# Altium project PPC_notebook_electrical_schematics_v0.6.PrjPcb (part 6 of 10)

## Sheet 19C_3G_LTE_MODEM.SchDoc
size 420 x 297 mm
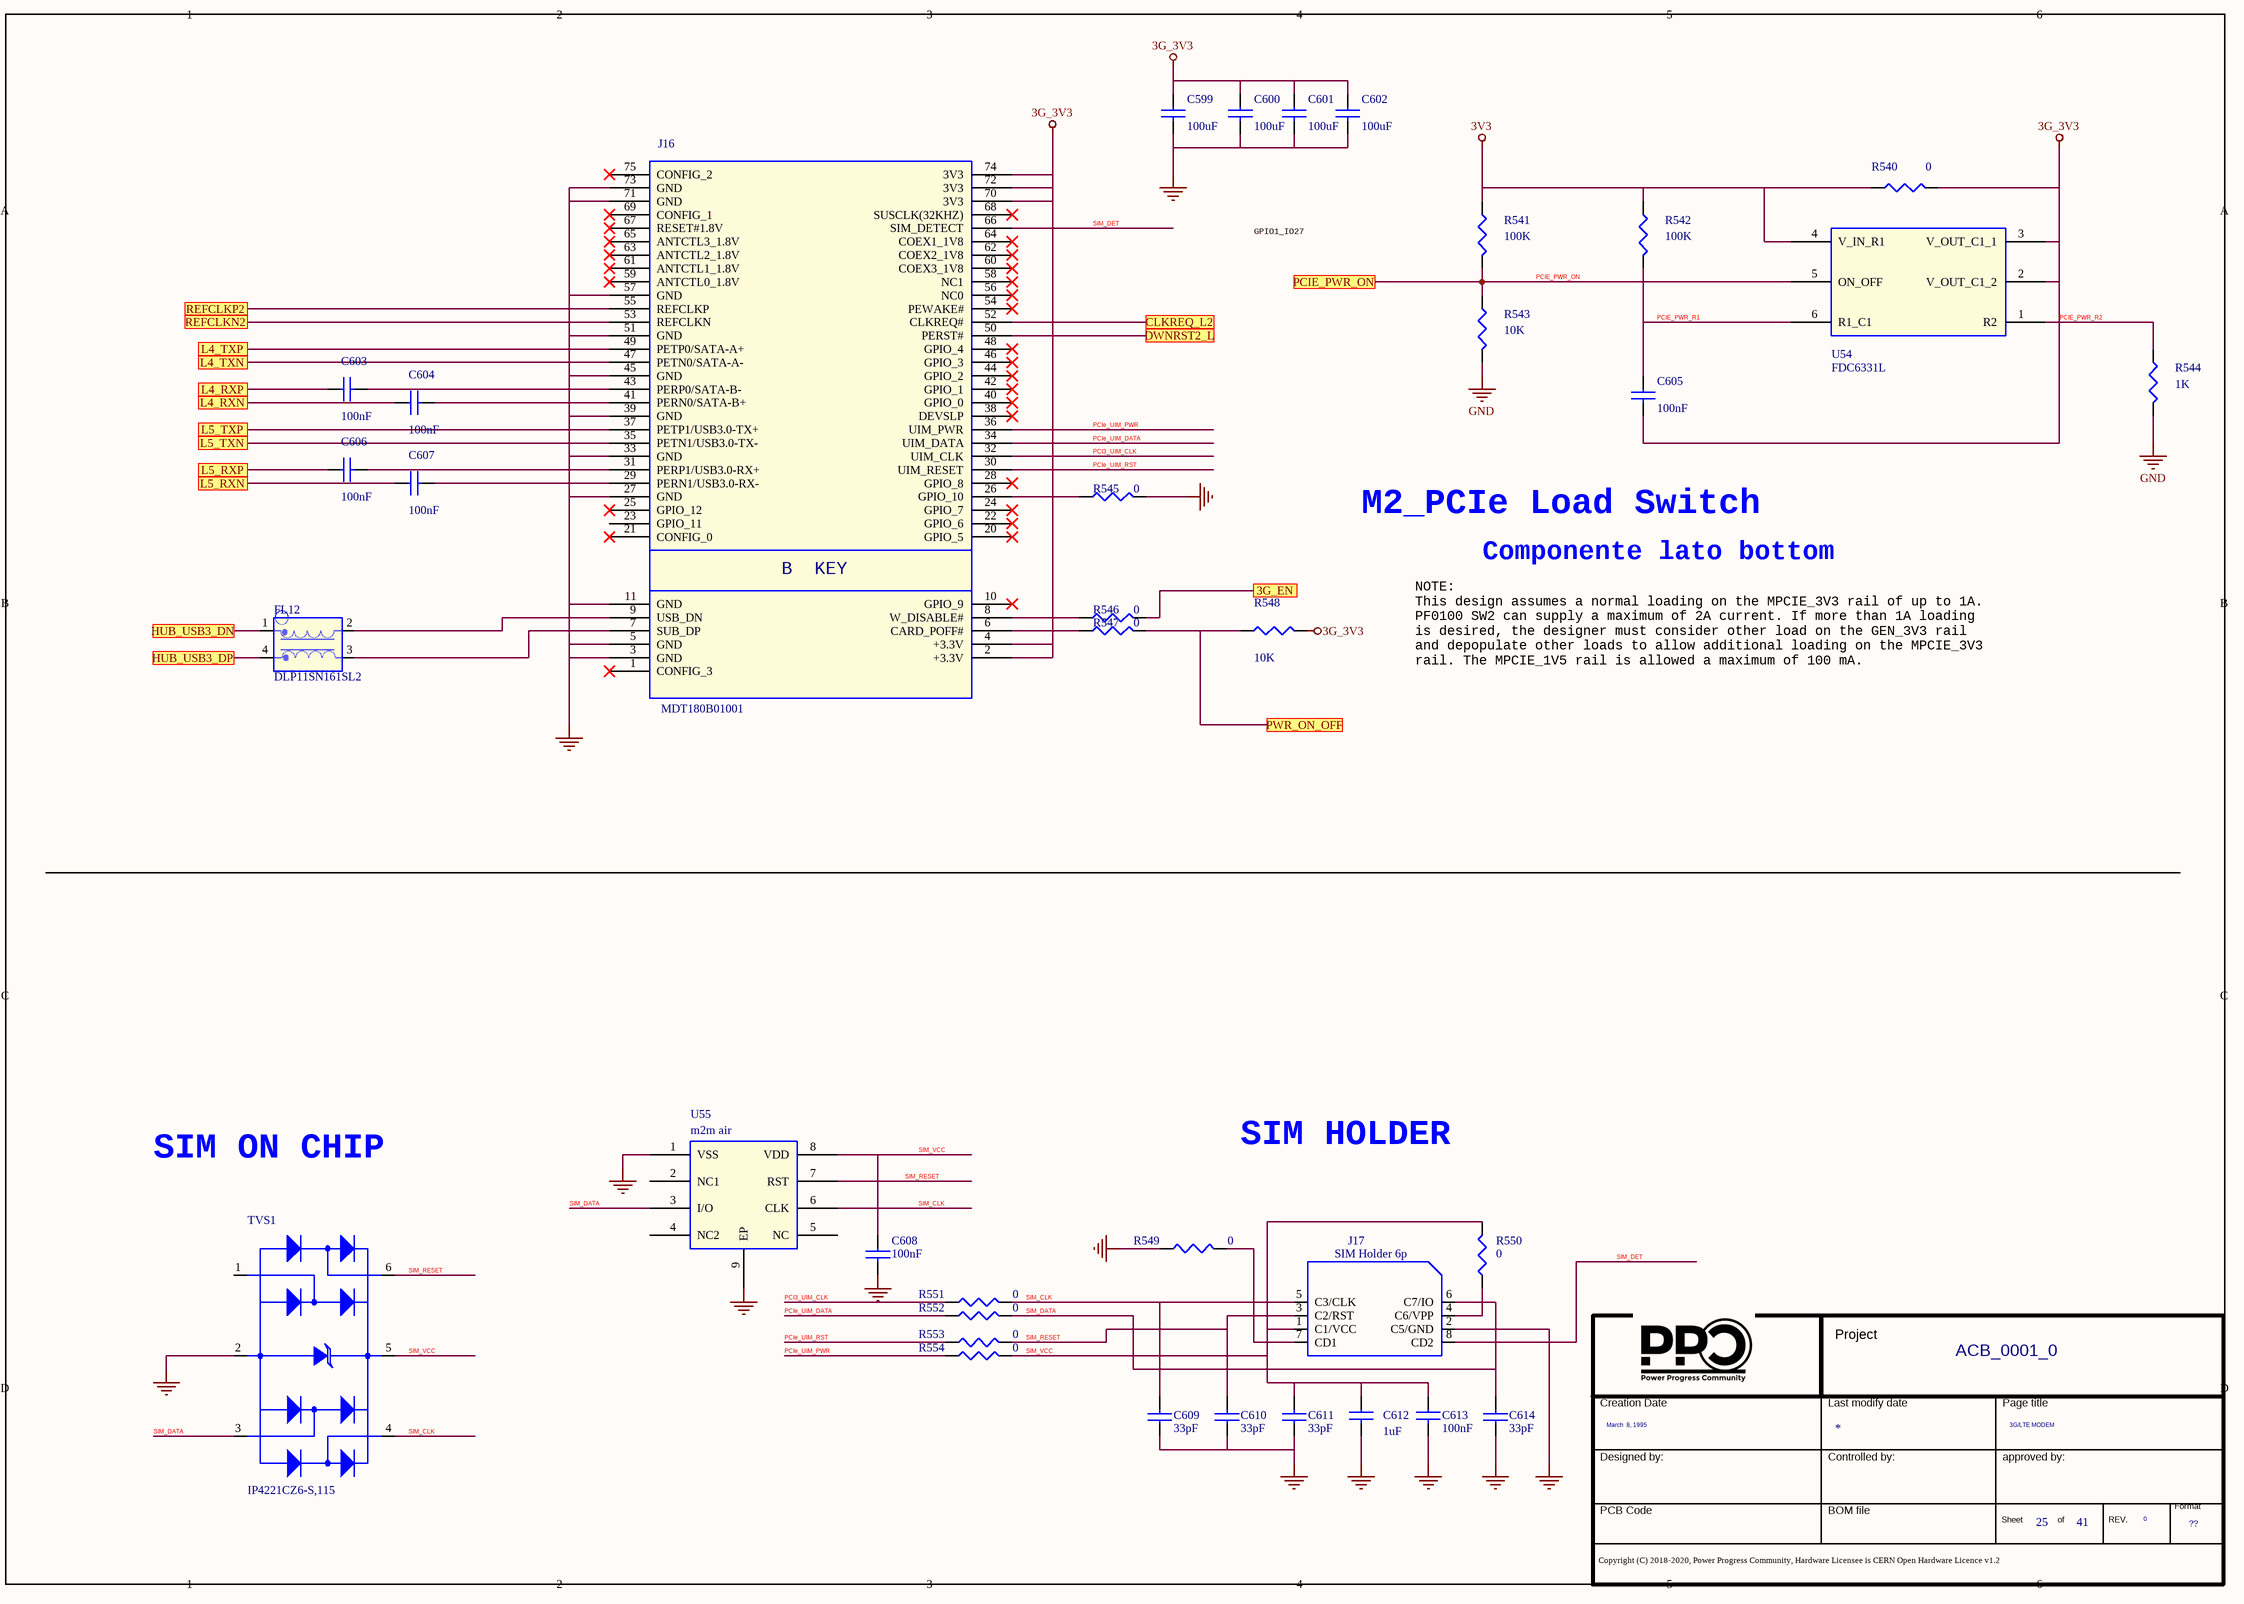
[diagram p40: 19C_3G_LTE_MODEM.SchDoc]

### Parts
(Parts that share a designator on the sheet are numbered #1, #2 ... from top to bottom, then left to right.)
*#27  Page Count: 41  Page Create Date: March  8, 1995  Page Number: 25  Page Size: ??  Page Title: 3G/LTE MODEM  RevCode: 0  Title: ACB_0001_0  (hidden comment: Title_block_PPC)  (graphical)
C599  100uF  [SMD_1210]
C600  100uF  [SMD_1210]
C601  100uF  [SMD_1210]
C602  100uF  [SMD_1210]
C603  100nF  [SMD_0402]
C604  100nF  [SMD_0402]
C605  100nF  [SMD_0402]
C606  100nF  [SMD_0402]
C607  100nF  [SMD_0402]
C608  100nF  [SMD_0402]
C609  33pF  [SMD_0402]
C610  33pF  [SMD_0402]
C611  33pF  [SMD_0402]
C612  1uF  [SMD_0402]
C613  100nF  [SMD_0402]
C614  33pF  [SMD_0402]
FL12  DLP11SN161SL2  [SMD]
J16  MDT180B01001  [67 PIN PASSO 0.5mm]
J17  SIM Holder 6p  [SMD 6 PIN]
R540  0  [SMD_1206]
R541  100K  [SMD_0402]
R542  100K  [SMD_0402]
R543  10K  [SMD_0402]
R544  1K  [SMD_0402]
R545  0  [SMD_0402]
R546  0  [SMD_0402]
R547  0  [SMD_0402]
R548  10K  [SMD_0402]
R549  0  [SMD_0402]
R550  0  [SMD_0402]
R551  0  [SMD_0402]
R552  0  [SMD_0402]
R553  0  [SMD_0402]
R554  0  [SMD_0402]
TVS1  IP4221CZ6-S,115  [	XSON-6]
U54  FDC6331L  [SOT_6]
U55  m2m air  [SO-8]

### Ports
3G_EN, CLKREQ_L2, DWNRST2_L, HUB_USB3_DN, HUB_USB3_DP, L4_RXN, L4_RXP, L4_TXN, L4_TXP, L5_RXN, L5_RXP, L5_TXN, L5_TXP, PCIE_PWR_ON, PWR_ON_OFF, REFCLKN2, REFCLKP2

### Nets
3V3: R540.1 R541.1 R542.1 U54.4(V_IN_R1)
GND: C599.2 C600.2 C601.2 C602.2 C608.2 C609.1 C610.1 C611.1 C612.2 C613.2 C614.1 J16.3(GND) J16.5(GND) J16.11(GND) J16.27(GND) J16.33(GND) J16.39(GND) J16.45(GND) J16.51(GND) J16.57(GND) J16.71(GND) J16.73(GND) J17.2(C5/GND) R543.2 R544.2 R545.2 R549.1 TVS1.2(GND) U55.1(VSS) U55.9(EP)
PCIE_PWR_R2: C599.1 C600.1 C601.1 C602.1 C605.2 J16.2(+3.3V) J16.4(+3.3V) J16.70(3V3) J16.72(3V3) J16.74(3V3) R540.2 R544.1 R548.2 U54.1(R2) U54.2(V_OUT_C1_2) U54.3(V_OUT_C1_1)  [also labelled 3G_3V3]
CLKREQ_L2: J16.52(CLKREQ#) ; port CLKREQ_L2
DWNRST2_L: J16.50(PERST#) ; port DWNRST2_L
L4_RXN: C604.1 ; port L4_RXN
L4_RXP: C603.1 ; port L4_RXP
L4_TXN: J16.47(PETN0/SATA-A-) ; port L4_TXN
L4_TXP: J16.49(PETP0/SATA-A+) ; port L4_TXP
L5_RXN: C607.1 ; port L5_RXN
L5_RXP: C606.1 ; port L5_RXP
L5_TXN: J16.35(PETN1/USB3.0-TX-) ; port L5_TXN
L5_TXP: J16.37(PETP1/USB3.0-TX+) ; port L5_TXP
PCI3_UIM_CLK: J16.32(UIM_CLK) R551.1
PCIE_PWR_ON: R541.2 R543.1 U54.5(ON_OFF) ; port PCIE_PWR_ON
PCIE_PWR_R1: C605.1 R542.2 U54.6(R1_C1)
PCIe_UIM_DATA: J16.34(UIM_DATA) R552.1
PCIe_UIM_PWR: J16.36(UIM_PWR) R554.1
PCIe_UIM_RST: J16.30(UIM_RESET) R553.1
SIM_CLK: C609.2 J17.5(C3/CLK) R551.2 TVS1.4(IO3) U55.6(CLK)
SIM_DATA: C614.2 J17.6(C7/IO) R552.2 TVS1.3(IO2) U55.3(I/O)
SIM_DET: J16.66(SIM_DETECT) J17.8(CD2)
SIM_RESET: C610.2 J17.3(C2/RST) R553.2 TVS1.6(IO4) U55.7(RST)
SIM_VCC: C608.1 C611.2 C612.1 C613.1 J17.1(C1/VCC) R550.2 R554.2 TVS1.5(VCC) U55.8(VDD)
NetC603_2: C603.2 J16.43(PERP0/SATA-B-)
NetC604_2: C604.2 J16.41(PERN0/SATA-B+)
NetC606_2: C606.2 J16.31(PERP1/USB3.0-RX+)
NetC607_2: C607.2 J16.29(PERN1/USB3.0-RX-)
NetFL12_1: FL12.1 ; port HUB_USB3_DN
NetFL12_2: FL12.2 J16.9(USB_DN)
NetFL12_3: FL12.3 J16.7(SUB_DP)
NetFL12_4: FL12.4 ; port HUB_USB3_DP
NetJ16_6: J16.6(CARD_POFF#) R547.1
NetJ16_8: J16.8(W_DISABLE#) R546.1
NetJ16_26: J16.26(GPIO_10) R545.1
NetJ16_53: J16.53(REFCLKN) ; port REFCLKN2
NetJ16_55: J16.55(REFCLKP) ; port REFCLKP2
NetJ17_4: J17.4(C6/VPP) R550.1
NetJ17_7: J17.7(CD1) R549.2
NetR344_2: R547.2 R548.1 ; port PWR_ON_OFF
NetR351_2: R546.2 ; port 3G_EN

Not connected (* = marked no-connect by the designer): J16 1(CONFIG_3)* 10(GPIO_9)* 20(GPIO_5)* 21(CONFIG_0)* 22(GPIO_6)* 23(GPIO_11) 24(GPIO_7)* 25(GPIO_12)* 28(GPIO_8)* 38(DEVSLP)* 40(GPIO_0)* 42(GPIO_1)* 44(GPIO_2)* 46(GPIO_3)* 48(GPIO_4)* 54(PEWAKE#)* 56(NC0)* 58(NC1)* 59(ANTCTL0_1.8V)* 60(COEX3_1V8)* 61(ANTCTL1_1.8V)* 62(COEX2_1V8)* 63(ANTCTL2_1.8V)* 64(COEX1_1V8)* 65(ANTCTL3_1.8V)* 67(RESET#1.8V)* 68(SUSCLK(32KHZ))* 69(CONFIG_1)* 75(CONFIG_2)*; TVS1 1(IO1); U55 2(NC1) 4(NC2) 5(NC)

### Notes on the sheet
- GPIO1_IO27
- M2_PCIe Load Switch
- NOTE:
  This design assumes a normal loading on the MPCIE_3V3 rail of up to 1A.
  PF0100 SW2 can supply a maximum of 2A current. If more than 1A loading
  is desired, the designer must consider other load on the GEN_3V3 rail
  and depopulate other loads to allow additional loading on the MPCIE_3V3
  rail. The MPCIE_1V5 rail is allowed a maximum of 100 mA.
- Componente lato bottom
- SIM ON CHIP
- SIM HOLDER
- (in symbol M2_B_KEY) B  KEY

### Library data of the parts
*#27 = Title_block_PPC: Schematic Page Count: 45; Schematic Page Number: 28; Page Modify Date: *
C599-C602 = CAP NP_Dup2: COND.CER.100uF 6,3V 1210 X5R 20% SMD; Part Number: PASSIVE_265; Manufacturer 1: Murata; Manufacturer Part Number 1: GRM32ER60J107ME20L; RSM: RC1210; PCB Footprint: SMD_1210; Part Type: Capacitors\Ceramic\SMD\1210; Distributor 1: MURATA ELETTRONICA SPA
C603 C604 C606 C607 = CAP NP_Dup2: COND.CER. 100NF 50V 0402 X7R SMD; Manufacturer Part Number 1: CGA2B3X7R1H104M050BD; Manufacturer 1: TDK; Part Number: PASSIVE_24; RSM: RC0402; PCB Footprint: SMD_0402; Part Type: Capacitors\Ceramic\SMD\0402
C605 = CAP NP_Dup5: COND.CER. 100NF 50V 0402 X7R SMD; Manufacturer Part Number 1: CGA2B3X7R1H104M050BD; Manufacturer 1: TDK; Part Number: PASSIVE_24; RSM: RC0402; TECNO77: C0402; PCB Footprint: SMD_0402; Distributor 1: MURATA ELETTRONICA SPA; Part Type: Capacitors\Ceramic\SMD\0402
C608 = CAP NP_Dup4: COND.CER. 100NF 50V 0402 X7R SMD; Part Number: PASSIVE_24; Manufacturer 1: TDK; Manufacturer Part Number 1: CGA2B3X7R1H104M050BD; LNK_PART: C0402X55; RSM: RC0402; TECNO77: C0402; PCB Footprint: SMD_0402; Part Type: Capacitors\Ceramic\SMD\0402; Distributor 1: MURATA ELETTRONICA SPA
C609-C611 = CAP NP_Dup4: COND.CER. 33PF 50V 0402 5% COG SMD; Manufacturer Part Number 1: GRM1555C1H330JZ01D_; Manufacturer 1: Murata; Part Number: PASSIVE_76; TECNO77: C0402; RSM: RC0402; PCB Footprint: SMD_0402; Distributor 1: MURATA ELETTRONICA SPA; Part Type: Capacitors\Ceramic\SMD\0402
C612 = CAP NP_Dup2: CAP CER 1UF 25V X6S 0402; Manufacturer Part Number 1: GRM155C81E105KE11D; Manufacturer 1: Murata; Part Number: PASSIVE_1446; RSM: RC0402; PCB Footprint: SMD_0402; Part Type: Capacitors\Ceramic\SMD\0402
C613 = CAP NP_Dup4: COND.CER. 100NF 50V 0402 X7R SMD; Part Number: PASSIVE_24; Manufacturer 1: TDK; Manufacturer Part Number 1: CGA2B3X7R1H104M050BD; RSM: RC0402; TECNO77: C0402; PCB Footprint: SMD_0402; Part Type: Capacitors\Ceramic\SMD\0402; Distributor 1: DIGKEY (445-9694-2-ND)
C614 = CAP NP_Dup4: COND.CER. 33PF 50V 0402 5% COG SMD; Part Number: PASSIVE_76; Manufacturer 1: Murata; Manufacturer Part Number 1: GRM1555C1H330JZ01D_; TECNO77: C0402; RSM: RC0402; PCB Footprint: SMD_0402; Part Type: Capacitors\Ceramic\SMD\0402; Distributor 1: MURATA ELETTRONICA SPA
FL12 = USB_CHOKE: CHOKE COMMON MODE 90 OHM 0805; Part Number: PASSIVE_1366; Manufacturer 1: Murata; Manufacturer Part Number 1: DLW21HN900SQ2L; RSM: EMI-DLW21; Part Type: FILTER; Distributor 1: DIGIKEY(490-1064-1-ND); PCB Footprint: SMD
J16 = M2_B_KEY: Connettori PCI Express/PCI 67P SMT RCPT H1.8 B Key; Manufacturer 1: AMPHENOL; Part Number: CONNECTORS_681; RSM: FCI-MDT180M01001; PCB Footprint: 67 PIN PASSO 0.5mm; Distributor 1: MOUSER(523-MDT180B01001); Manufacturer Part Number 1: MDT180B01001; Part Type: CON_M2
J17 = SIMHOLD_6_PIN_AVX_OK: CONNECTOR SIM CARD W/OUT BOSS; Part Number: CONNECTORS_333; Manufacturer 1: AVX; Manufacturer Part Number 1: 045036006211862+; TECNO77: CN-SIM-KYOCERA-5036006; RSM: AVX-SIM-045036006211862; PCB Footprint: SMD 6 PIN; Part Type: SOCKET\SIM_HOLDER; Distributor 1: Mouser(581-045036006211862+)
R540 = R_Dup7: RESIS. 0R 1/4W 1206 SMD E96; Part Number: PASSIVE_1266; Manufacturer 1: YAGEO; Manufacturer Part Number 1: RC1206JR-070RL; TECNO77: R1206; RSM: RC1206; PCB Footprint: SMD_1206; Part Type: Resistors\Fixed\SMD\1206\5%; Distributor 1: TTI ITALY SRL
R541 R542 = R_Dup5: RESIS.CHIP 100K 5% 0402 SMD; Manufacturer 1: ROYAL OHM; Part Number: PASSIVE_813; RSM: RC0402; Manufacturer Part Number 1: RESIS.CHIP 100K 5% 0402 SMD; PCB Footprint: SMD_0402; Part Type: Resistors\Fixed\SMD\0402\5%
R543 R548 = R_Dup5: as R453 on sheet 18 USB3_ports; Manufacturer Part Number 1: RESIS.CHIP 10K 1% 0402 SMD; PCB Footprint: SMD_0402; Part Type: Resistors\Fixed\SMD\0402\1%
R544 = R_Dup5: RESIS.CHIP 1K 1% 0402 SMD; Manufacturer 1: ROYAL OHM; Part Number: PASSIVE_628; RSM: RC0402; Manufacturer Part Number 1: RESIS.CHIP 1K 1% 0402 SMD; PCB Footprint: SMD_0402; Part Type: Resistors\Fixed\SMD\0402\1%
R545-R547 = R_Dup8: as R530 on sheet 19B WLAN_CONNECTOR; PCB Footprint: SMD_0402; Part Type: Resistors\Fixed\SMD\0402\5%; Manufacturer Part Number 1: RESIS.CHIP 0R 5% 0402 SMD; Distributor 1: CAMEL ELETTRONICA SRL  #
R549 R554 = R_Dup6: RESIS.CHIP 0R 5% 0402 SMD; Manufacturer 1: ROYAL OHM; Part Number: PASSIVE_805; TECNO77: R0402; RSM: RC0402; PCB Footprint: SMD_0402; Distributor 1: CAMEL ELETTRONICA SRL  #; Manufacturer Part Number 1: RESIS.CHIP 0R 5% 0402 SMD; Part Type: Resistors\Fixed\SMD\0402\5%
R550 = R_Dup4: RESIS.CHIP 0R 5% 0402 SMD; Part Number: PASSIVE_805; Manufacturer 1: ROYAL OHM; TECNO77: R0402; RSM: RC0402; PCB Footprint: SMD_0402; Part Type: Resistors\Fixed\SMD\0402\5%; Manufacturer Part Number 1: RESIS.CHIP 0R 5% 0402 SMD; Distributor 1: CAMEL ELETTRONICA SRL  #
R551-R553 = R_Dup6: RESIS.CHIP 0R 5% 0402 SMD; Part Number: PASSIVE_805; Manufacturer 1: ROYAL OHM; TECNO77: R0402; RSM: RC0402; PCB Footprint: SMD_0402; Part Type: Resistors\Fixed\SMD\0402\5%; Manufacturer Part Number 1: RESIS.CHIP 0R 5% 0402 SMD; Distributor 1: CAMEL ELETTRONICA SRL  #
TVS1 = TVS_ETHERNET: TVS ESD Dual INTEG ESD Protection SPI; Manufacturer 1: NXP; Part Number: DISCRETE_218; PCB Footprint: XSON-6; TECNO77: DFN6-1X1.45-P0.5; RSM: SOT-886; Distributor 1: MOUSER(771-IP4221CZ6-S,115 ); Manufacturer Part Number 1: IP4221CZ6-S,115; Part Type: Protections
U54 = FDC6331L: LOAD SWITCH INT 8VIN SSOT-6; Part Number: LINEAR_78; CLASS: IC; TECNO77: SOT23-6; PRIORITY_PN: 051-FDC6331L; AGILE_PN: 315-78829; MFG_NAME01: FAIRCHILD; CAD_APPROVED: Yes; RSM: SSOT6-P-0_95; PCB Footprint: SOT_6; Part Type: PowerSW; Manufacturer Part Number 1: FDC6331L; MFG_PN01: FDC6331L; ROHS: Yes; HEIGHT: 1.1MM; Manufacturer 1: FAIRCHILD; Distributor 1: DIGIKEY (FDC6331LCT-ND)
U55 = MIM_0: MIM m2m air Telit; Part Number: MEMORIES_60; RSM: VQFN-8-5X6; PCB Footprint: VQFN-8; Part Type: MIM; Manufacturer 1: Telit

## Sheet 19 PCIE BRIDGE.SchDoc
size 594 x 420 mm
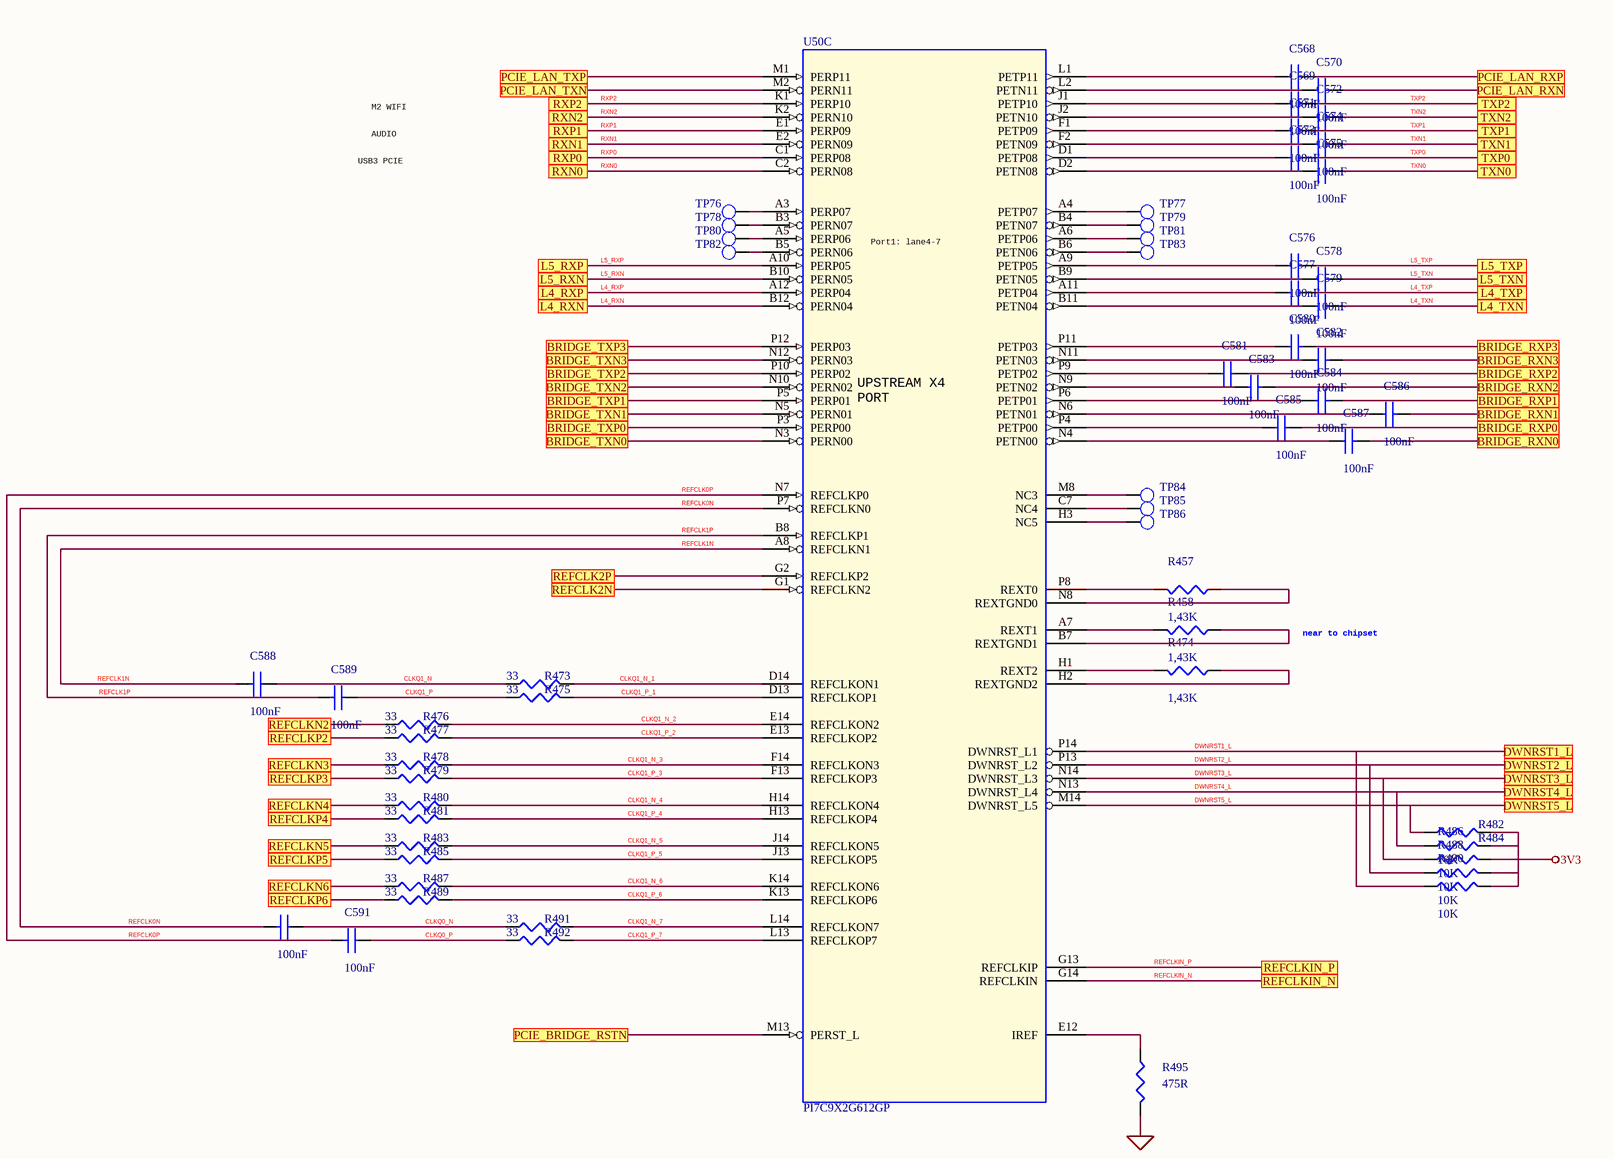
[diagram p41: 19 PCIE BRIDGE.SchDoc, top left]
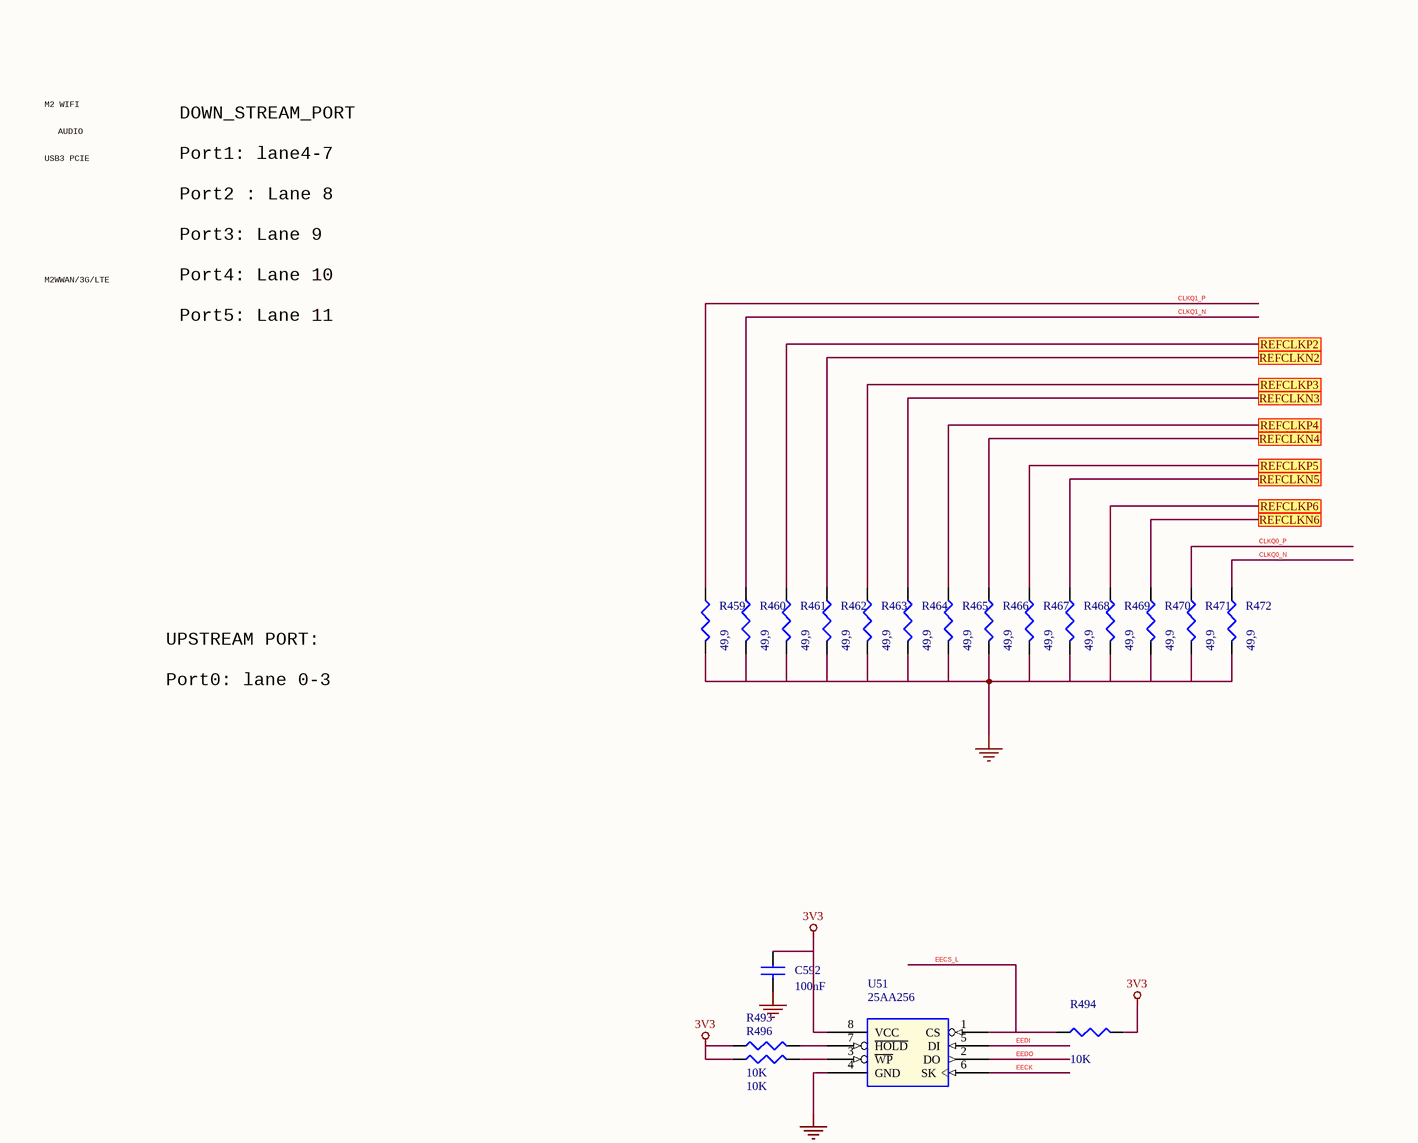
[diagram p42: 19 PCIE BRIDGE.SchDoc, top right]
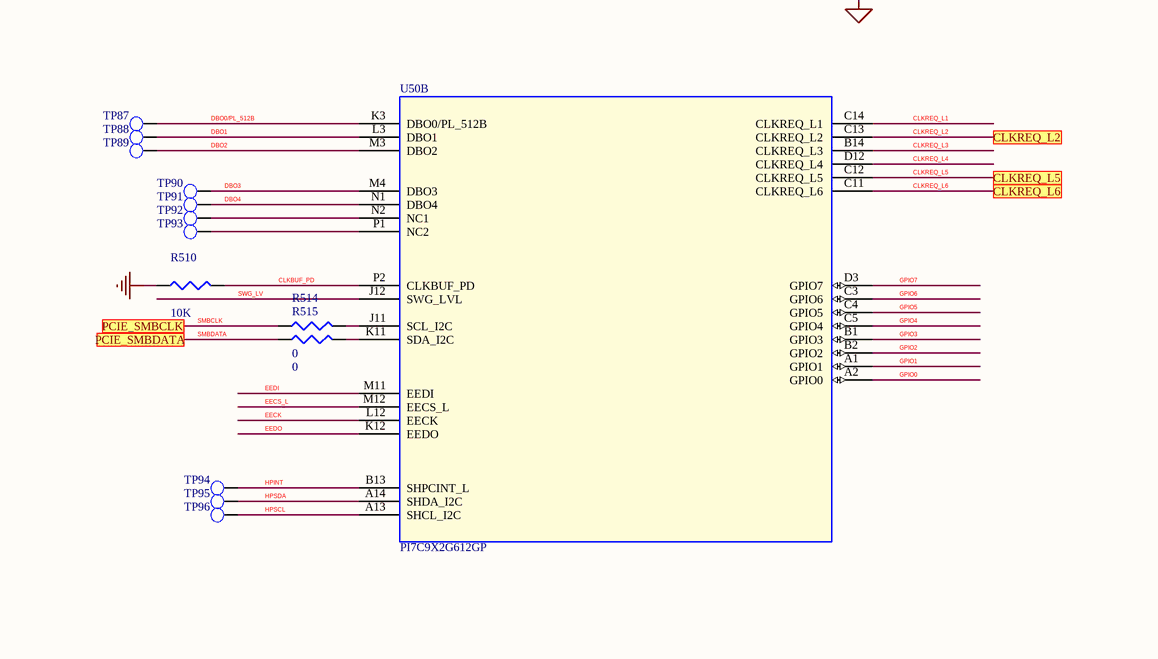
[diagram p43: 19 PCIE BRIDGE.SchDoc, bottom left]
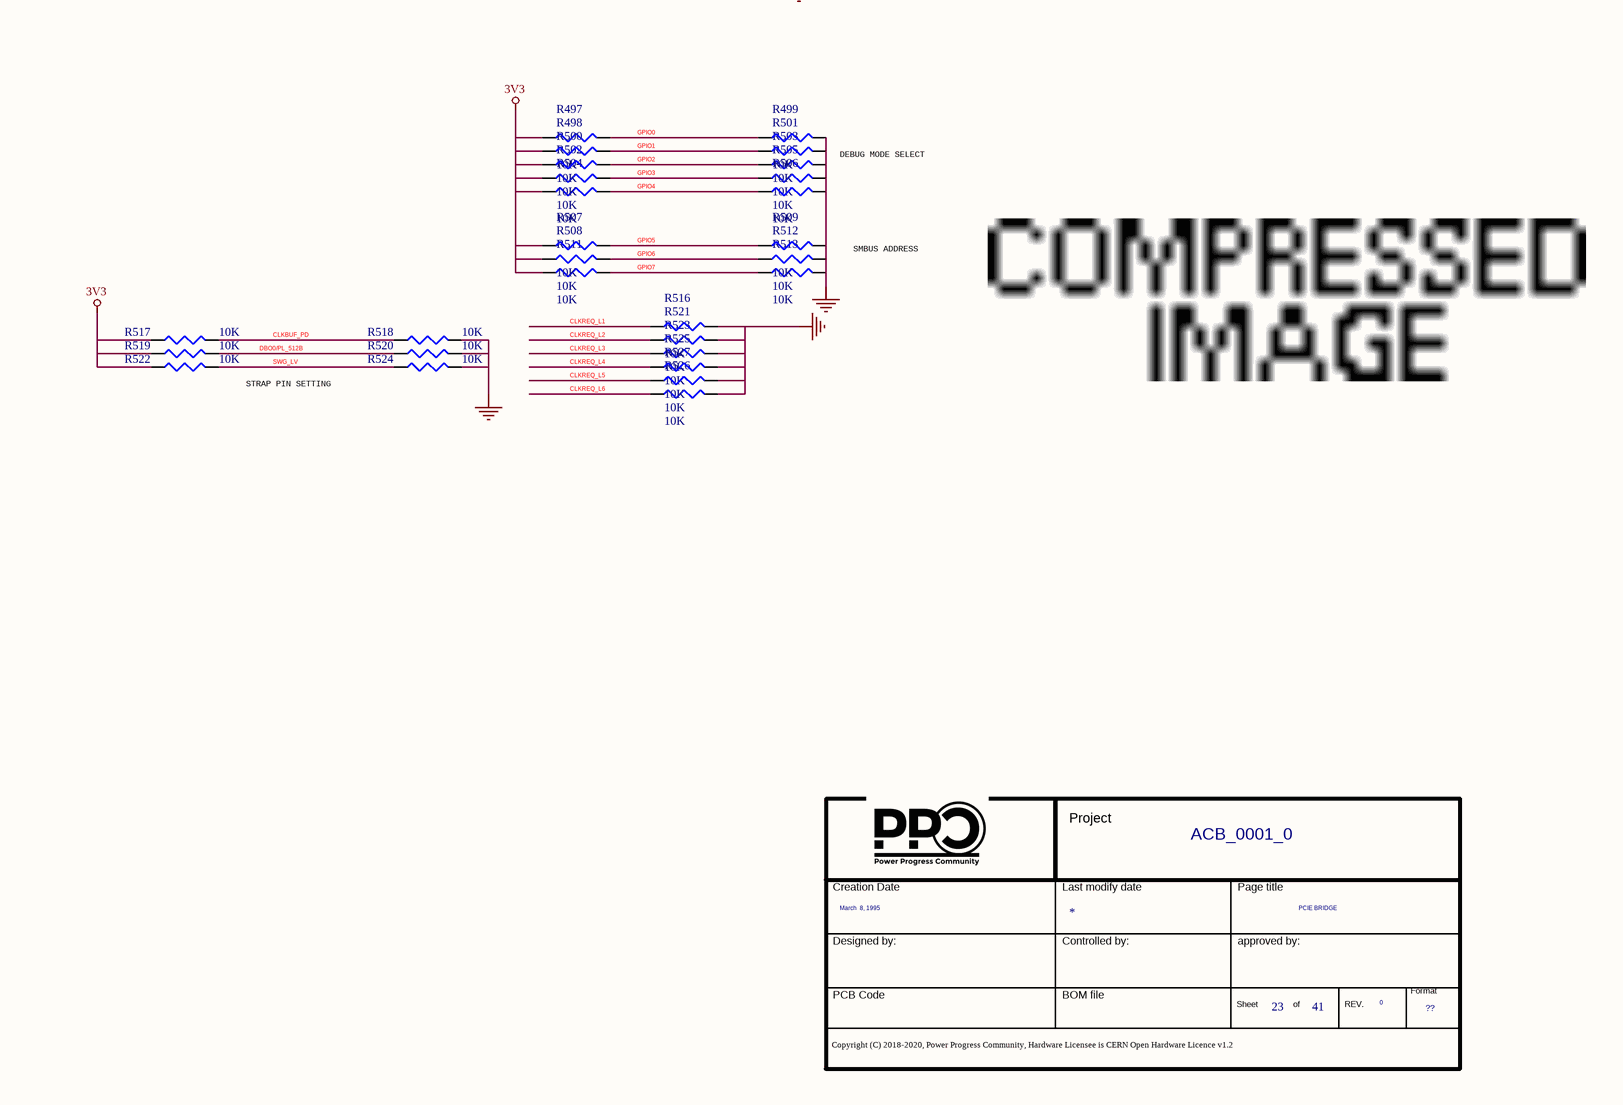
[diagram p44: 19 PCIE BRIDGE.SchDoc, bottom right]

### Parts
(Parts that share a designator on the sheet are numbered #1, #2 ... from top to bottom, then left to right.)
*#28  Page Count: 41  Page Create Date: March  8, 1995  Page Number: 23  Page Size: ??  Page Title: PCIE BRIDGE  RevCode: 0  Title: ACB_0001_0  (hidden comment: Title_block_PPC)  (graphical)
C568  100nF  [SMD_0402]
C569  100nF  [SMD_0402]
C570  100nF  [SMD_0402]
C571  100nF  [SMD_0402]
C572  100nF  [SMD_0402]
C573  100nF  [SMD_0402]
C574  100nF  [SMD_0402]
C575  100nF  [SMD_0402]
C576  100nF  [SMD_0402]
C577  100nF  [SMD_0402]
C578  100nF  [SMD_0402]
C579  100nF  [SMD_0402]
C580  100nF  [SMD_0201]
C581  100nF  [SMD_0201]
C582  100nF  [SMD_0201]
C583  100nF  [SMD_0201]
C584  100nF  [SMD_0201]
C585  100nF  [SMD_0201]
C586  100nF  [SMD_0201]
C587  100nF  [SMD_0201]
C588  100nF  [SMD_0603]
C589  100nF  [SMD_0603]
C590  100nF  [SMD_0402]
C591  100nF  [SMD_0402]
C592  100nF  [SMD_0201]
R457  1,43K  [SMD_0402]
R458  1,43K  [SMD_0402]
R459  49,9  [SMD_0402]
R460  49,9  [SMD_0402]
R461  49,9  [SMD_0402]
R462  49,9  [SMD_0402]
R463  49,9  [SMD_0402]
R464  49,9  [SMD_0402]
R465  49,9  [SMD_0402]
R466  49,9  [SMD_0402]
R467  49,9  [SMD_0402]
R468  49,9  [SMD_0402]
R469  49,9  [SMD_0402]
R470  49,9  [SMD_0402]
R471  49,9  [SMD_0402]
R472  49,9  [SMD_0402]
R473  33  [SMD_0402]
R474  1,43K  [SMD_0402]
R475  33  [SMD_0402]
R476  33  [SMD_0402]
R477  33  [SMD_0402]
R478  33  [SMD_0402]
R479  33  [SMD_0402]
R480  33  [SMD_0402]
R481  33  [SMD_0402]
R482  10K  [SMD_0402]
R483  33  [SMD_0402]
R484  10K  [SMD_0402]
R485  33  [SMD_0402]
R486  10K  [SMD_0402]
R487  33  [SMD_0402]
R488  10K  [SMD_0402]
R489  33  [SMD_0402]
R490  10K  [SMD_0402]
R491  33  [SMD_0402]
R492  33  [SMD_0402]
R493  10K  [SMD_0402]
R494  10K  [SMD_0402]
R495  475R  [SMD_0402]
R496  10K  [SMD_0402]
R497  10K  [SMD_0402]
R498  10K  [SMD_0402]
R499  10K  [SMD_0402]
R500  10K  [SMD_0402]
R501  10K  [SMD_0402]
R502  10K  [SMD_0402]
R503  10K  [SMD_0402]
R504  10K  [SMD_0402]
R505  10K  [SMD_0402]
R506  10K  [SMD_0402]
R507  10K  [SMD_0402]
R508  10K  [SMD_0402]
R509  10K  [SMD_0402]
R510  10K  [SMD_0402]
R511  10K  [SMD_0402]
R512  10K  [SMD_0402]
R513  10K  [SMD_0402]
R514  0  [SMD_0402]
R515  0  [SMD_0402]
R516  10K  [SMD_0402]
R517  10K  [SMD_0402]
R518  10K  [SMD_0402]
R519  10K  [SMD_0402]
R520  10K  [SMD_0402]
R521  10K  [SMD_0402]
R522  10K  [SMD_0402]
R523  10K  [SMD_0402]
R524  10K  [SMD_0402]
R525  10K  [SMD_0402]
R526  10K  [SMD_0402]
R527  10K  [SMD_0402]
TP76  TEST POINT  [PCB]  (value not drawn)
TP77  TEST POINT  [PCB]  (value not drawn)
TP78  TEST POINT  [PCB]  (value not drawn)
TP79  TEST POINT  [PCB]  (value not drawn)
TP80  TEST POINT  [PCB]  (value not drawn)
TP81  TEST POINT  [PCB]  (value not drawn)
TP82  TEST POINT  [PCB]  (value not drawn)
TP83  TEST POINT  [PCB]  (value not drawn)
TP84  TEST POINT  [PCB]  (value not drawn)
TP85  TEST POINT  [PCB]  (value not drawn)
TP86  TEST POINT  [PCB]  (value not drawn)
TP87  TEST POINT  [PCB]  (value not drawn)
TP88  TEST POINT  [PCB]  (value not drawn)
TP89  TEST POINT  [PCB]  (value not drawn)
TP90  TEST POINT  [PCB]  (value not drawn)
TP91  TEST POINT  [PCB]  (value not drawn)
TP92  TEST POINT  [PCB]  (value not drawn)
TP93  TEST POINT  [PCB]  (value not drawn)
TP94  TEST POINT  [PCB]  (value not drawn)
TP95  TEST POINT  [PCB]  (value not drawn)
TP96  TEST POINT  [PCB]  (value not drawn)
U50  PI7C9X2G612GP  [LQFP]  (parts B,C of 3)
U51  25AA256  [SOIC8]

### Ports
BRIDGE_RXN0, BRIDGE_RXN1, BRIDGE_RXN2, BRIDGE_RXN3, BRIDGE_RXP0, BRIDGE_RXP1, BRIDGE_RXP2, BRIDGE_RXP3, BRIDGE_TXN0, BRIDGE_TXN1, BRIDGE_TXN2, BRIDGE_TXN3, BRIDGE_TXP0, BRIDGE_TXP1, BRIDGE_TXP2, BRIDGE_TXP3, CLKREQ_L2, CLKREQ_L5, CLKREQ_L6, DWNRST1_L, DWNRST2_L, DWNRST3_L, DWNRST4_L, DWNRST5_L, L4_RXN, L4_RXP, L4_TXN, L4_TXP, L5_RXN, L5_RXP, L5_TXN, L5_TXP, PCIE_BRIDGE_RSTN, PCIE_LAN_RXN, PCIE_LAN_RXP, PCIE_LAN_TXN, PCIE_LAN_TXP, PCIE_SMBCLK, PCIE_SMBDATA, REFCLK2N, REFCLK2P, REFCLKIN_N, REFCLKIN_P, REFCLKN2, REFCLKN3, REFCLKN4, REFCLKN5, REFCLKN6, REFCLKP2, REFCLKP3, REFCLKP4, REFCLKP5, REFCLKP6, RXN0, RXN1, RXN2, RXP0, RXP1, RXP2, TXN0, TXN1, TXN2, TXP0, TXP1, TXP2

### Nets
3V3: C592.1 R482.2 R484.2 R486.2 R488.2 R490.2 R493.1 R494.2 R496.1 R497.1 R498.1 R500.1 R502.1 R504.1 R507.1 R508.1 R511.1 R517.1 R519.1 R522.1 U51.8(VCC)
GND: C592.2 R459.2 R460.2 R461.2 R462.2 R463.2 R464.2 R465.2 R466.2 R467.2 R468.2 R469.2 R470.2 R471.2 R472.2 R495.2 R499.2 R501.2 R503.2 R505.2 R506.2 R509.2 R510.2 R512.2 R513.2 R516.2 R518.2 R520.2 R521.2 R523.2 R524.2 R525.2 R526.2 R527.2 U51.4(GND)
CLKBUF_PD: R510.1 R517.2 R518.1 U50.P2(CLKBUF_PD)
CLKQ0_N: C590.1 R472.1 R491.2
CLKQ0_P: C591.1 R471.1 R492.2
CLKQ1_N: C588.1 R460.1 R473.2
CLKQ1_N_1: R473.1 U50.D14(REFCLKON1)
CLKQ1_N_2: R476.1 U50.E14(REFCLKON2)
CLKQ1_N_3: R478.1 U50.F14(REFCLKON3)
CLKQ1_N_4: R480.1 U50.H14(REFCLKON4)
CLKQ1_N_5: R483.1 U50.J14(REFCLKON5)
CLKQ1_N_6: R487.1 U50.K14(REFCLKON6)
CLKQ1_N_7: R491.1 U50.L14(REFCLKON7)
CLKQ1_P: C589.1 R459.1 R475.2
CLKQ1_P_1: R475.1 U50.D13(REFCLKOP1)
CLKQ1_P_2: R477.1 U50.E13(REFCLKOP2)
CLKQ1_P_3: R479.1 U50.F13(REFCLKOP3)
CLKQ1_P_4: R481.1 U50.H13(REFCLKOP4)
CLKQ1_P_5: R485.1 U50.J13(REFCLKOP5)
CLKQ1_P_6: R489.1 U50.K13(REFCLKOP6)
CLKQ1_P_7: R492.1 U50.L13(REFCLKOP7)
CLKREQ_L1: R516.1 U50.C14(CLKREQ_L1)
CLKREQ_L2: R521.1 U50.C13(CLKREQ_L2) ; port CLKREQ_L2
CLKREQ_L3: R523.1 U50.B14(CLKREQ_L3)
CLKREQ_L4: R525.1 U50.D12(CLKREQ_L4)
CLKREQ_L5: R527.1 U50.C12(CLKREQ_L5) ; port CLKREQ_L5
CLKREQ_L6: R526.1 U50.C11(CLKREQ_L6) ; port CLKREQ_L6
DBO0/PL_512B: R519.2 R520.1 TP87.1(TP) U50.K3(DBO0/PL_512B)
DBO1: TP88.1(TP) U50.L3(DBO1)
DBO2: TP89.1(TP) U50.M3(DBO2)
DBO3: TP90.1(TP) U50.M4(DBO3)
DBO4: TP91.1(TP) U50.N1(DBO4)
DWNRST1_L: R490.1 U50.P14(DWNRST_L1) ; port DWNRST1_L
DWNRST2_L: R488.1 U50.P13(DWNRST_L2) ; port DWNRST2_L
DWNRST3_L: R486.1 U50.N14(DWNRST_L3) ; port DWNRST3_L
DWNRST4_L: R484.1 U50.N13(DWNRST_L4) ; port DWNRST4_L
DWNRST5_L: R482.1 U50.M14(DWNRST_L5) ; port DWNRST5_L
EECK: U50.L12(EECK) U51.6(SK)
EECS_L: R494.1 U50.M12(EECS_L) U51.1(CS)
EEDI: U50.M11(EEDI) U51.5(DI)
EEDO: U50.K12(EEDO) U51.2(DO)
GPIO0: R497.2 R499.1 U50.A2(GPIO0)
GPIO1: R498.2 R501.1 U50.A1(GPIO1)
GPIO2: R500.2 R503.1 U50.B2(GPIO2)
GPIO3: R502.2 R505.1 U50.B1(GPIO3)
GPIO4: R504.2 R506.1 U50.C5(GPIO4)
GPIO5: R507.2 R509.1 U50.C4(GPIO5)
GPIO6: R508.2 R512.1 U50.C3(GPIO6)
GPIO7: R511.2 R513.1 U50.D3(GPIO7)
HPINT: TP94.1(TP) U50.B13(SHPCINT_L)
HPSCL: TP96.1(TP) U50.A13(SHCL_I2C)
HPSDA: TP95.1(TP) U50.A14(SHDA_I2C)
L4_RXN: U50.B12(PERN04) ; port L4_RXN
L4_RXP: U50.A12(PERP04) ; port L4_RXP
L4_TXN: C579.2 ; port L4_TXN
L4_TXP: C577.2 ; port L4_TXP
L5_RXN: U50.B10(PERN05) ; port L5_RXN
L5_RXP: U50.A10(PERP05) ; port L5_RXP
L5_TXN: C578.2 ; port L5_TXN
L5_TXP: C576.2 ; port L5_TXP
REFCLK0N: C590.2 U50.P7(REFCLKN0)
REFCLK0P: C591.2 U50.N7(REFCLKP0)
REFCLK1N: C588.2 U50.A8(REFCLKN1)
REFCLK1P: C589.2 U50.B8(REFCLKP1)
REFCLK2N: U50.G1(REFCLKN2) ; port REFCLK2N
REFCLK2P: U50.G2(REFCLKP2) ; port REFCLK2P
REFCLKIN_N: U50.G14(REFCLKIN) ; port REFCLKIN_N
REFCLKIN_P: U50.G13(REFCLKIP) ; port REFCLKIN_P
RXN0: U50.C2(PERN08) ; port RXN0
RXN1: U50.E2(PERN09) ; port RXN1
RXN2: U50.K2(PERN10) ; port RXN2
RXP0: U50.C1(PERP08) ; port RXP0
RXP1: U50.E1(PERP09) ; port RXP1
RXP2: U50.K1(PERP10) ; port RXP2
SMBCLK: R514.1 ; port PCIE_SMBCLK
SMBDATA: R515.1 ; port PCIE_SMBDATA
SWG_LV: R522.2 R524.1 U50.J12(SWG_LVL)
TXN0: C575.2 ; port TXN0
TXN1: C574.2 ; port TXN1
TXN2: C572.2 ; port TXN2
TXP0: C573.2 ; port TXP0
TXP1: C571.2 ; port TXP1
TXP2: C569.2 ; port TXP2
NetC84_2: U50.P3(PERP00) ; port BRIDGE_TXP0
NetC85_2: U50.N3(PERN00) ; port BRIDGE_TXN0
NetC86_2: U50.P5(PERP01) ; port BRIDGE_TXP1
NetC87_2: U50.N5(PERN01) ; port BRIDGE_TXN1
NetC88_2: U50.P10(PERP02) ; port BRIDGE_TXP2
NetC89_2: U50.N10(PERN02) ; port BRIDGE_TXN2
NetC90_2: U50.P12(PERP03) ; port BRIDGE_TXP3
NetC92_2: U50.N12(PERN03) ; port BRIDGE_TXN3
NetC568_1: C568.1 U50.L1(PETP11)
NetC568_2: C568.2 ; port PCIE_LAN_RXP
NetC569_1: C569.1 U50.J1(PETP10)
NetC570_1: C570.1 U50.L2(PETN11)
NetC570_2: C570.2 ; port PCIE_LAN_RXN
NetC571_1: C571.1 U50.F1(PETP09)
NetC572_1: C572.1 U50.J2(PETN10)
NetC573_1: C573.1 U50.D1(PETP08)
NetC574_1: C574.1 U50.F2(PETN09)
NetC575_1: C575.1 U50.D2(PETN08)
NetC576_1: C576.1 U50.A9(PETP05)
NetC577_1: C577.1 U50.A11(PETP04)
NetC578_1: C578.1 U50.B9(PETN05)
NetC579_1: C579.1 U50.B11(PETN04)
NetC580_1: C580.1 U50.P11(PETP03)
NetC580_2: C580.2 ; port BRIDGE_RXP3
NetC581_1: C581.1 U50.P9(PETP02)
NetC581_2: C581.2 ; port BRIDGE_RXP2
NetC582_1: C582.1 U50.N11(PETN03)
NetC582_2: C582.2 ; port BRIDGE_RXN3
NetC583_1: C583.1 U50.N9(PETN02)
NetC583_2: C583.2 ; port BRIDGE_RXN2
NetC584_1: C584.1 U50.P6(PETP01)
NetC584_2: C584.2 ; port BRIDGE_RXP1
NetC585_1: C585.1 U50.P4(PETP00)
NetC585_2: C585.2 ; port BRIDGE_RXP0
NetC586_1: C586.1 U50.N6(PETN01)
NetC586_2: C586.2 ; port BRIDGE_RXN1
NetC587_1: C587.1 U50.N4(PETN00)
NetC587_2: C587.2 ; port BRIDGE_RXN0
NetJ14_17: U50.M1(PERP11) ; port PCIE_LAN_TXP
NetJ14_18: U50.M2(PERN11) ; port PCIE_LAN_TXN
NetJ14_20: R469.1 R489.2 ; port REFCLKP6
NetJ14_21: R470.1 R487.2 ; port REFCLKN6
NetJ15_47: R467.1 R485.2 ; port REFCLKP5
NetJ15_49: R468.1 R483.2 ; port REFCLKN5
NetJ16_53: R462.1 R476.2 ; port REFCLKN2
NetJ16_55: R461.1 R477.2 ; port REFCLKP2
NetR288_2: U50.M13(PERST_L) ; port PCIE_BRIDGE_RSTN
NetR441_1: R463.1 R479.2 ; port REFCLKP3
NetR442_1: R464.1 R478.2 ; port REFCLKN3
NetR457_1: R457.1 U50.P8(REXT0)
NetR457_2: R457.2 U50.N8(REXTGND0)
NetR458_1: R458.1 U50.A7(REXT1)
NetR458_2: R458.2 U50.B7(REXTGND1)
NetR465_1: R465.1 R481.2 ; port REFCLKP4
NetR466_1: R466.1 R480.2 ; port REFCLKN4
NetR474_1: R474.1 U50.H1(REXT2)
NetR474_2: R474.2 U50.H2(REXTGND2)
NetR493_2: R493.2 U51.7(~{HOLD})
NetR495_1: R495.1 U50.E12(IREF)
NetR496_2: R496.2 U51.3(~{WP})
NetR514_2: R514.2 U50.J11(SCL_I2C)
NetR515_2: R515.2 U50.K11(SDA_I2C)
NetTP76_1: TP76.1(TP) U50.A3(PERP07)
NetTP77_1: TP77.1(TP) U50.A4(PETP07)
NetTP78_1: TP78.1(TP) U50.B3(PERN07)
NetTP79_1: TP79.1(TP) U50.B4(PETN07)
NetTP80_1: TP80.1(TP) U50.A5(PERP06)
NetTP81_1: TP81.1(TP) U50.A6(PETP06)
NetTP82_1: TP82.1(TP) U50.B5(PERN06)
NetTP83_1: TP83.1(TP) U50.B6(PETN06)
NetTP84_1: TP84.1(TP) U50.M8(NC3)
NetTP85_1: TP85.1(TP) U50.C7(NC4)
NetTP86_1: TP86.1(TP) U50.H3(NC5)
NetTP92_1: TP92.1(TP) U50.N2(NC1)
NetTP93_1: TP93.1(TP) U50.P1(NC2)

### Notes on the sheet
- AUDIO
- M2 WIFI
- DOWN_STREAM_PORT
  Port1: lane4-7
  Port2 : Lane 8
  Port3: Lane 9
  Port4: Lane 10
  Port5: Lane 11
- USB3 PCIE
- (near U50) Port1: lane4-7
- M2WWAN/3G/LTE
- (near U50) UPSTREAM X4
  PORT
- UPSTREAM PORT:
  Port0: lane 0-3
- near to chipset
- DEBUG MODE SELECT
- SMBUS ADDRESS
- STRAP PIN SETTING

### Library data of the parts
*#28 = Title_block_PPC: Schematic Page Count: 45; Schematic Page Number: 26; Page Modify Date: *
C568-C579 = CAP NP_Dup2: COND.CER. 100NF 50V 0402 X7R SMD; Part Number: PASSIVE_24; Manufacturer 1: TDK; Manufacturer Part Number 1: CGA2B3X7R1H104M050BD; RSM: RC0402; Part Type: Capacitors\Ceramic\SMD\0402; PCB Footprint: SMD_0402
C580-C587 C592 = CAP NP_Dup2: CAP CER 0.1UF 6.3V 20% X5R 0201; Manufacturer Part Number 1: C0603X5R0J104M030BC; Manufacturer 1: TDK; Part Number: PASSIVE_3; RSM: RC0201; PCB Footprint: SMD_0201; Part Type: Capacitors\Ceramic\SMD\0201
C588 C589 = CAP NP_Dup2: COND.CER.100NF 50V 0603 X7R SMD; Manufacturer Part Number 1: ECJ1VB1H104K; Manufacturer 1: PANASONIC; Part Number: PASSIVE_118; RSM: RC0603; PCB Footprint: SMD_0603; Part Type: Capacitors\Ceramic\SMD\0603
C590 C591 = CAP NP_Dup2: as C603 on sheet 19C_3G_LTE_MODEM; PCB Footprint: SMD_0402; Part Type: Capacitors\Ceramic\SMD\0402
R457 R458 R474 = R_Dup5: RESIS.CHIP 1,43K 1% 0402 SMD; Manufacturer 1: ROYAL OHM; Part Number: PASSIVE_1462; RSM: RC0402; Manufacturer Part Number 1: RESIS.CHIP 1,43K 1% 0402 SMD; PCB Footprint: SMD_0402; Part Type: Resistors\Fixed\SMD\0402\1%
R459-R470 = R_Dup5: RESIS.CHIP 49,9R 1% 0402 SMD; Manufacturer Part Number 1: NCR04F49R9TRF; Manufacturer 1: NIC; Part Number: PASSIVE_738; RSM: RC0402; Distributor 1: MODULI ELETTRONICI E COMPONENTI spa; Part Type: Resistors\Fixed\SMD\0402\1%; PCB Footprint: SMD_0402
R471 R472 = R_Dup5: RESIS.CHIP 49,9R 1% 0402 SMD; Part Number: PASSIVE_738; Manufacturer 1: NIC; Manufacturer Part Number 1: NCR04F49R9TRF; RSM: RC0402; Part Type: Resistors\Fixed\SMD\0402\1%; Distributor 1: MODULI ELETTRONICI E COMPONENTI spa; PCB Footprint: SMD_0402
R473 R476 R477 R479 R481 R485 R489 R492 = R_Dup5: RESIS.CHIP 33R 5% 0402 SMD; Part Number: PASSIVE_853; Manufacturer 1: ROYAL OHM; RSM: RC0402; Part Type: Resistors\Fixed\SMD\0402\5%; Manufacturer Part Number 1: RESIS.CHIP 33R 5% 0402 SMD; Distributor 1: CAMEL ELETTRONICA SRL  #; PCB Footprint: SMD_0402
R475 R478 R480 R483 R487 R491 = R_Dup5: RESIS.CHIP 33R 5% 0402 SMD; Manufacturer 1: ROYAL OHM; Part Number: PASSIVE_853; RSM: RC0402; Distributor 1: CAMEL ELETTRONICA SRL  #; Manufacturer Part Number 1: RESIS.CHIP 33R 5% 0402 SMD; Part Type: Resistors\Fixed\SMD\0402\5%; PCB Footprint: SMD_0402
R482 R484 = R_Dup5: as R453 on sheet 18 USB3_ports; Manufacturer Part Number 1: RESIS.CHIP 10K 1% 0402 SMD; Part Type: Resistors\Fixed\SMD\0402\1%; PCB Footprint: SMD_0402
R486 R488 R490 R493 R494 R496-R513 R516-R527 = R_Dup5: RESIS.CHIP 10K 1% 0402 SMD; Part Number: PASSIVE_584; Manufacturer 1: ROYAL OHM; RSM: RC0402; Part Type: Resistors\Fixed\SMD\0402\1%; PCB Footprint: SMD_0402; Manufacturer Part Number 1: RESIS.CHIP 10K 1% 0402 SMD
R495 = R_Dup5: RESIS.CHIP 475R 1% 0402 SMD; Manufacturer Part Number 1: ERJ-2RKF4750X ( COMP.); Manufacturer 1: PANASONIC ECG; Part Number: PASSIVE_736; RSM: RC0402; PCB Footprint: SMD_0402; Part Type: Resistors\Fixed\SMD\0402\1%
R514 = R_Dup5: RESIS.CHIP 0R 5% 0402 SMD; Manufacturer 1: ROYAL OHM; Part Number: PASSIVE_805; RSM: RC0402; Manufacturer Part Number 1: RESIS.CHIP 0R 5% 0402 SMD; PCB Footprint: SMD_0402; Part Type: Resistors\Fixed\SMD\0402\5%
R515 = R_Dup5: RESIS.CHIP 0R 5% 0402 SMD; Manufacturer 1: ROYAL OHM; Part Number: PASSIVE_805; RSM: RC1206; Manufacturer Part Number 1: RESIS.CHIP 0R 5% 0402 SMD; PCB Footprint: SMD_0402; Part Type: Resistors\Fixed\SMD\0402\5%
TP76-TP96 = T POINT R: TEST POINT SU PCB; Part Number: CONNECTORS_542; RSM: AE-TESTPOINT; Part Type: Tpoint; PCB Footprint: PCB
U50 = PI7C9X2G612GP: PCI 6 Ports 6Lanes PCIE2 Packet Switch; Manufacturer Part Number 1: PI7C9X2G612GPCNJE; Manufacturer 1: DIODES; Part Number: LOGIC_342; PCB Footprint: LBGA_196; RSM: LGA-196-15_15; Distributor 1: MOUSER( 729-PI7C9X2G612GPCNJ ); Part Type: PCIE\SWITCH
U51 = SPI_EEPROM_1: IC SPI EEPROM 256KBIT 10MHZ 8SOIC; Part Number: MEMORIES_11; Manufacturer 1: MICROCHIP; Manufacturer Part Number 1: 25AA256-I/SN; RSM: SO-8; Part Type: EEPROM; Distributor 1: DIGIKEY (25AA256-I/SN-ND); PCB Footprint: SOIC8

## Sheet 20 PCIE BRIDGE POWER.SchDoc
size 420 x 297 mm
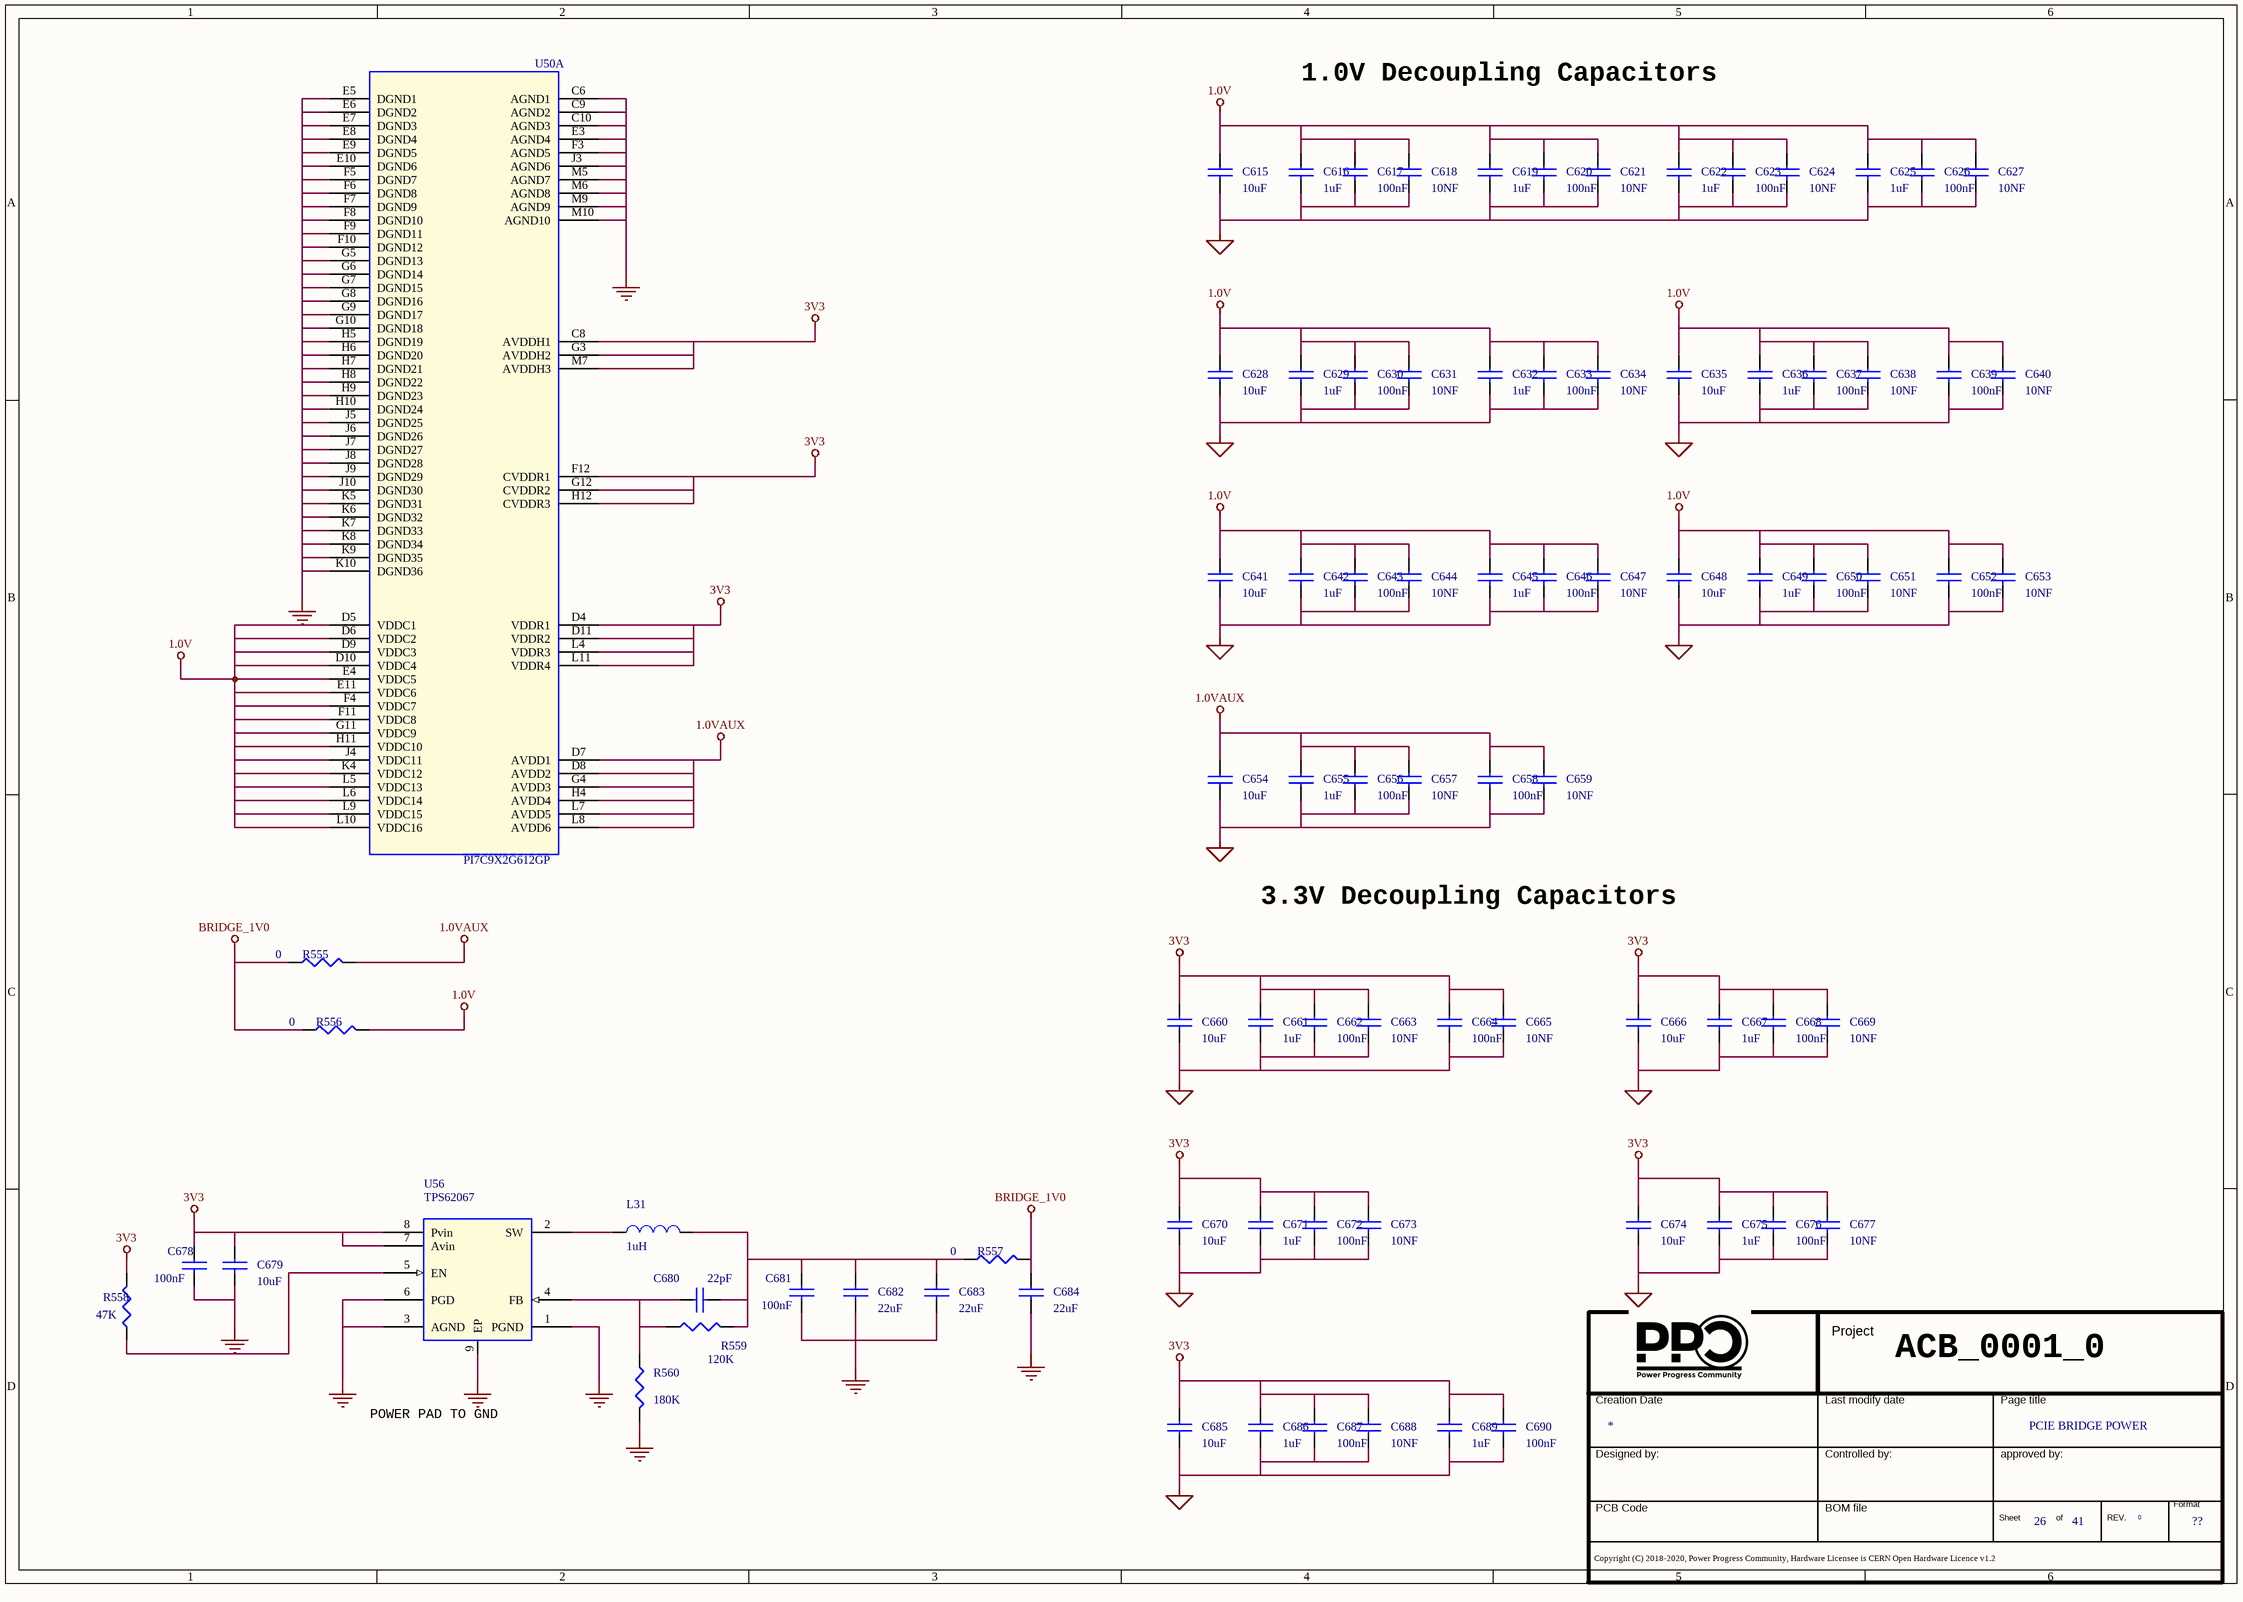
[diagram p45: 20 PCIE BRIDGE POWER.SchDoc]

### Parts
(Parts that share a designator on the sheet are numbered #1, #2 ... from top to bottom, then left to right.)
*#29  Doc: PCIE BRIDGE POWER  Page Count: 41  Page Number: 26  Page Size: ??  RevCode: 0  (hidden comment: Title_block_PPC)  (graphical)
C615  10uF  [SMD_0603]
C616  1uF  [SMD_0402]
C617  100nF  [SMD_0201]
C618  10NF  [SMD_0402]
C619  1uF  [SMD_0402]
C620  100nF  [SMD_0201]
C621  10NF  [SMD_0402]
C622  1uF  [SMD_0402]
C623  100nF  [SMD_0201]
C624  10NF  [SMD_0402]
C625  1uF  [SMD_0402]
C626  100nF  [SMD_0201]
C627  10NF  [SMD_0402]
C628  10uF  [SMD_0603]
C629  1uF  [SMD_0402]
C630  100nF  [SMD_0201]
C631  10NF  [SMD_0402]
C632  1uF  [SMD_0402]
C633  100nF  [SMD_0201]
C634  10NF  [SMD_0402]
C635  10uF  [SMD_0603]
C636  1uF  [SMD_0402]
C637  100nF  [SMD_0201]
C638  10NF  [SMD_0402]
C639  100nF  [SMD_0201]
C640  10NF  [SMD_0402]
C641  10uF  [SMD_0603]
C642  1uF  [SMD_0402]
C643  100nF  [SMD_0201]
C644  10NF  [SMD_0402]
C645  1uF  [SMD_0402]
C646  100nF  [SMD_0201]
C647  10NF  [SMD_0402]
C648  10uF  [SMD_0603]
C649  1uF  [SMD_0402]
C650  100nF  [SMD_0201]
C651  10NF  [SMD_0402]
C652  100nF  [SMD_0201]
C653  10NF  [SMD_0402]
C654  10uF  [SMD_0603]
C655  1uF  [SMD_0402]
C656  100nF  [SMD_0201]
C657  10NF  [SMD_0402]
C658  100nF  [SMD_0201]
C659  10NF  [SMD_0402]
C660  10uF  [SMD_0603]
C661  1uF  [SMD_0402]
C662  100nF  [SMD_0201]
C663  10NF  [SMD_0402]
C664  100nF  [SMD_0201]
C665  10NF  [SMD_0402]
C666  10uF  [SMD_0603]
C667  1uF  [SMD_0402]
C668  100nF  [SMD_0201]
C669  10NF  [SMD_0402]
C670  10uF  [SMD_0603]
C671  1uF  [SMD_0402]
C672  100nF  [SMD_0201]
C673  10NF  [SMD_0402]
C674  10uF  [SMD_0603]
C675  1uF  [SMD_0402]
C676  100nF  [SMD_0201]
C677  10NF  [SMD_0402]
C678  100nF  [SMD_0402]
C679  10uF  [SMD_0603]
C680  22pF  [SMD_0402]
C681  100nF  [SMD_0402]
C682  22uF  [SMD_0805]
C683  22uF  [SMD_0805]
C684  22uF  [SMD_0805]
C685  10uF  [SMD_0603]
C686  1uF  [SMD_0402]
C687  100nF  [SMD_0201]
C688  10NF  [SMD_0402]
C689  1uF  [SMD_0402]
C690  100nF  [SMD_0201]
L31  1uH  [Ind_2016]
R555  0  [SMD_0402]
R556  0  [SMD_0402]
R557  0  [SMD_0402]
R558  47K  [SMD_0402]
R559  120K  [SMD_0402]
R560  180K  [SMD_0402]
U50  PI7C9X2G612GP  [LQFP]  (part A of 3)
U56  TPS62067  [WSON8]

### Nets
1.0V: C615.1 C616.1 C617.1 C618.1 C619.1 C620.1 C621.1 C622.1 C623.1 C624.1 C625.1 C626.1 C627.1 C628.1 C629.1 C630.1 C631.1 C632.1 C633.1 C634.1 C635.1 C636.1 C637.1 C638.1 C639.1 C640.1 C641.1 C642.1 C643.1 C644.1 C645.1 C646.1 C647.1 C648.1 C649.1 C650.1 C651.1 C652.1 C653.1 R556.2 U50.D5(VDDC1) U50.D6(VDDC2) U50.D9(VDDC3) U50.D10(VDDC4) U50.E4(VDDC5) U50.E11(VDDC6) U50.F4(VDDC7) U50.F11(VDDC8) U50.G11(VDDC9) U50.H11(VDDC10) U50.J4(VDDC11) U50.K4(VDDC12) U50.L5(VDDC13) U50.L6(VDDC14) U50.L9(VDDC15) U50.L10(VDDC16)
1.0VAUX: C654.1 C655.1 C656.1 C657.1 C658.1 C659.1 R555.2 U50.D7(AVDD1) U50.D8(AVDD2) U50.G4(AVDD3) U50.H4(AVDD4) U50.L7(AVDD5) U50.L8(AVDD6)
3V3: C660.1 C661.1 C662.1 C663.1 C664.1 C665.1 C666.1 C667.1 C668.1 C669.1 C670.1 C671.1 C672.1 C673.1 C674.1 C675.1 C676.1 C677.1 C678.1 C679.1 C685.1 C686.1 C687.1 C688.1 C689.1 C690.1 R558.1 U50.C8(AVDDH1) U50.D4(VDDR1) U50.D11(VDDR2) U50.F12(CVDDR1) U50.G3(AVDDH2) U50.G12(CVDDR2) U50.H12(CVDDR3) U50.L4(VDDR3) U50.L11(VDDR4) U50.M7(AVDDH3) U56.7(Avin) U56.8(Pvin)
BRIDGE_1V0: C684.1 R555.1 R556.1 R557.2
GND: C615.2 C616.2 C617.2 C618.2 C619.2 C620.2 C621.2 C622.2 C623.2 C624.2 C625.2 C626.2 C627.2 C628.2 C629.2 C630.2 C631.2 C632.2 C633.2 C634.2 C635.2 C636.2 C637.2 C638.2 C639.2 C640.2 C641.2 C642.2 C643.2 C644.2 C645.2 C646.2 C647.2 C648.2 C649.2 C650.2 C651.2 C652.2 C653.2 C654.2 C655.2 C656.2 C657.2 C658.2 C659.2 C660.2 C661.2 C662.2 C663.2 C664.2 C665.2 C666.2 C667.2 C668.2 C669.2 C670.2 C671.2 C672.2 C673.2 C674.2 C675.2 C676.2 C677.2 C678.2 C679.2 C681.2 C682.2 C683.2 C684.2 C685.2 C686.2 C687.2 C688.2 C689.2 C690.2 R560.2 U50.C6(AGND1) U50.C9(AGND2) U50.C10(AGND3) U50.E3(AGND4) U50.E5(DGND1) U50.E6(DGND2) U50.E7(DGND3) U50.E8(DGND4) U50.E9(DGND5) U50.E10(DGND6) U50.F3(AGND5) U50.F5(DGND7) U50.F6(DGND8) U50.F7(DGND9) U50.F8(DGND10) U50.F9(DGND11) U50.F10(DGND12) U50.G5(DGND13) U50.G6(DGND14) U50.G7(DGND15) U50.G8(DGND16) U50.G9(DGND17) U50.G10(DGND18) U50.H5(DGND19) U50.H6(DGND20) U50.H7(DGND21) U50.H8(DGND22) U50.H9(DGND23) U50.H10(DGND24) U50.J3(AGND6) U50.J5(DGND25) U50.J6(DGND26) U50.J7(DGND27) U50.J8(DGND28) U50.J9(DGND29) U50.J10(DGND30) U50.K5(DGND31) U50.K6(DGND32) U50.K7(DGND33) U50.K8(DGND34) U50.K9(DGND35) U50.K10(DGND36) U50.M5(AGND7) U50.M6(AGND8) U50.M9(AGND9) U50.M10(AGND10) U56.1(PGND) U56.3(AGND) U56.6(PGD) U56.9(EP)
NetC680_1: C680.1 R559.1 R560.1 U56.4(FB)
NetC680_2: C680.2 C681.1 C682.1 C683.1 L31.2 R557.1 R559.2
NetL31_1: L31.1 U56.2(SW)
NetR558_2: R558.2 U56.5(EN)

### Notes on the sheet
- 1.0V Decoupling Capacitors
- 3.3V Decoupling Capacitors
- ACB_0001_0
- POWER PAD TO GND

### Library data of the parts
*#29 = Title_block_PPC: Title: T2080PCIe; Schematic Page Count: 45; Schematic Page Number: 29; Author: MICETEK; Page Create Date: March  8, 1995; Page Title: ?; Page Modify Date: *
C615 C628 C635 C641 C648 C654 C660 C666 C670 C674 C685 = CAP NP_Dup2: COND.CER.10uF 0603 25V SMD; Manufacturer Part Number 1: CL10A106MA8NRNC; Manufacturer 1: SAMSUNG; Part Number: PASSIVE_124; RSM: RC0603; PCB Footprint: SMD_0603; Part Type: Capacitors\Ceramic\SMD\0603
C616 C619 C622 C625 C629 C632 C636 C642 C645 C649 C655 C661 C667 C671 C675 C686 C689 = CAP NP_Dup2: as C612 on sheet 19C_3G_LTE_MODEM; PCB Footprint: SMD_0402; Part Type: Capacitors\Ceramic\SMD\0402
C617 C620 C623 C626 C630 C633 C637 C639 C643 C646 C650 C652 C656 C658 C662 C664 C668 C672 C676 C687 C690 = CAP NP_Dup2: CAP CER 0.1UF 6.3V 20% X5R 0201; Part Number: PASSIVE_3; Manufacturer 1: TDK; Manufacturer Part Number 1: C0603X5R0J104M030BC; RSM: RC0201; Part Type: Capacitors\Ceramic\SMD\0201; PCB Footprint: SMD_0201
C618 C621 C624 C627 C631 C634 C638 C640 C644 C647 C651 C653 C657 C659 C663 C665 C669 C673 C677 C688 = CAP NP_Dup2: COND.CER. 10NF 16V 0402 X7R SMD; Part Number: PASSIVE_28; Manufacturer 1: AVX; Manufacturer Part Number 1: 0402YC103KAT2A; RSM: RC0402; Part Type: Capacitors\Ceramic\SMD\0402; PCB Footprint: SMD_0402
C678 C681 = CAP NP_Dup9: COND.CER. 100NF 50V 0402 X7R SMD; LNK_PART: C0402X55; Part Number: PASSIVE_24; Manufacturer 1: TDK; Manufacturer Part Number 1: CGA2B3X7R1H104M050BD; Tecno77: RC0402; PCB Footprint: SMD_0402; Part Type: Capacitors\Ceramic\SMD\0402; Distributor 1: MURATA ELETTRONICA SPA; RSM: RC0402
C679 = CAP NP_Dup3: COND.CER.10uF 0603 25V SMD; Part Number: PASSIVE_124; Manufacturer 1: SAMSUNG; Manufacturer Part Number 1: CL10A106MA8NRNC; LNK_PART: GRM188R60J106ME47D; RSM: RC0603; PCB Footprint: SMD_0603; Part Type: Capacitors\Ceramic\SMD\0603; Distributor 1: MOUSER (81-GRM188R60J106ME47)
C680 = CAP NP_Dup9: COND.CER. 22PF 50V 0402 NPO 5% SMD; Part Number: PASSIVE_65; Manufacturer 1: Murata; Manufacturer Part Number 1: GRM1555C1H220JZ01; RSM: RC0402; PCB Footprint: SMD_0402; Part Type: Capacitors\Ceramic\SMD\0402; Distributor 1: MURATA ELETTRONICA SPA
C682-C684 = CAP NP_Dup2: as C563 on sheet 18 USB3_ports; PCB Footprint: SMD_0805; Part Type: Capacitors\Ceramic\SMD\0805
L31 = INDUCTOR: Induttori fissi 1.0uH 2.08A 68mOhms Pwr Circuit Inductor; Manufacturer Part Number 1: VLS201612CX-1R0M; Manufacturer 1: TDK; Part Number: PASSIVE_424; RSM: IND-TDK-VLS-2016; Distributor 1: MOUSER(810-VLS201612CX-1R0M  ); Part Type: Inductors\SMD; PCB Footprint: Ind_2016
R555 = R_Dup4: RESIS.CHIP 0R 5% 0402 SMD; LNK_PART: R0402X55; Manufacturer 1: ROYAL OHM; Part Number: PASSIVE_805; RSM: RC0402; PCB Footprint: SMD_0402; Distributor 1: CAMEL ELETTRONICA SRL  #; Manufacturer Part Number 1: RESIS.CHIP 0R 5% 0402 SMD; Part Type: Resistors\Fixed\SMD\0402\5%
R556 R557 = R_Dup4: RESIS.CHIP 0R 5% 0402 SMD; Part Number: PASSIVE_805; Manufacturer 1: ROYAL OHM; LNK_PART: R0402X55; RSM: RC0402; PCB Footprint: SMD_0402; Part Type: Resistors\Fixed\SMD\0402\5%; Manufacturer Part Number 1: RESIS.CHIP 0R 5% 0402 SMD; Distributor 1: CAMEL ELETTRONICA SRL  #
R558 = R_Dup4: RESIS.CHIP 47K 1% 0402 SMD; Part Number: PASSIVE_737; Manufacturer 1: ROYAL OHM; LNK_PART: R0402X55; Tecno77: RC0402; PCB Footprint: SMD_0402; Part Type: Resistors\Fixed\SMD\0402\1%; Manufacturer Part Number 1: RESIS.CHIP 47K 1% 0402 SMD; Distributor 1: CAMEL ELETTRONICA SRL  #; RSM: RC0402
R559 = R_Dup8: RESIS.CHIP 120K 1% 0402 SMD; Part Number: PASSIVE_593; Manufacturer 1: WALSIN; Manufacturer Part Number 1: WR04W1203FTL; RSM: RC0402; PCB Footprint: SMD_0402; Part Type: Resistors\Fixed\SMD\0402\1%; Distributor 1: MODULI ELETTRONICI E COMPONENTI spa
R560 = R_Dup8: RESIS.CHIP 180K 1% 0402 SMD; Manufacturer 1: ROYAL OHM; Part Number: PASSIVE_624; RSM: RC0402; PCB Footprint: SMD_0402; Distributor 1: CAMEL ELETTRONICA SRL  #; Manufacturer Part Number 1: RESIS.CHIP 180K 1% 0402 SMD; Part Type: Resistors\Fixed\SMD\0402\1%
U50 = PI7C9X2G612GP: PCI 6 Ports 6Lanes PCIE2 Packet Switch; Manufacturer Part Number 1: PI7C9X2G612GPCNJE; Manufacturer 1: DIODES; Part Number: LOGIC_342; PCB Footprint: LBGA_196; RSM: LGA-196-15X15; Distributor 1: MOUSER( 729-PI7C9X2G612GPCNJ ); Part Type: PCIE\SWITCH
U56 = TPS62067: IC REG BUCK SYNC ADJ 2A 8WSON; Part Number: LINEAR_251; Manufacturer 1: TEXAS; Manufacturer Part Number 1: TPS62067DSGT; RSM: WSON-8-2_1X2_1; PCB Footprint: WSON8; Part Type: Regulators\Switching; Distributor 1: DIGIKEY (296-27205-1-ND)

## Sheet 21 MXM_PCIe.SchDoc
size 594 x 420 mm
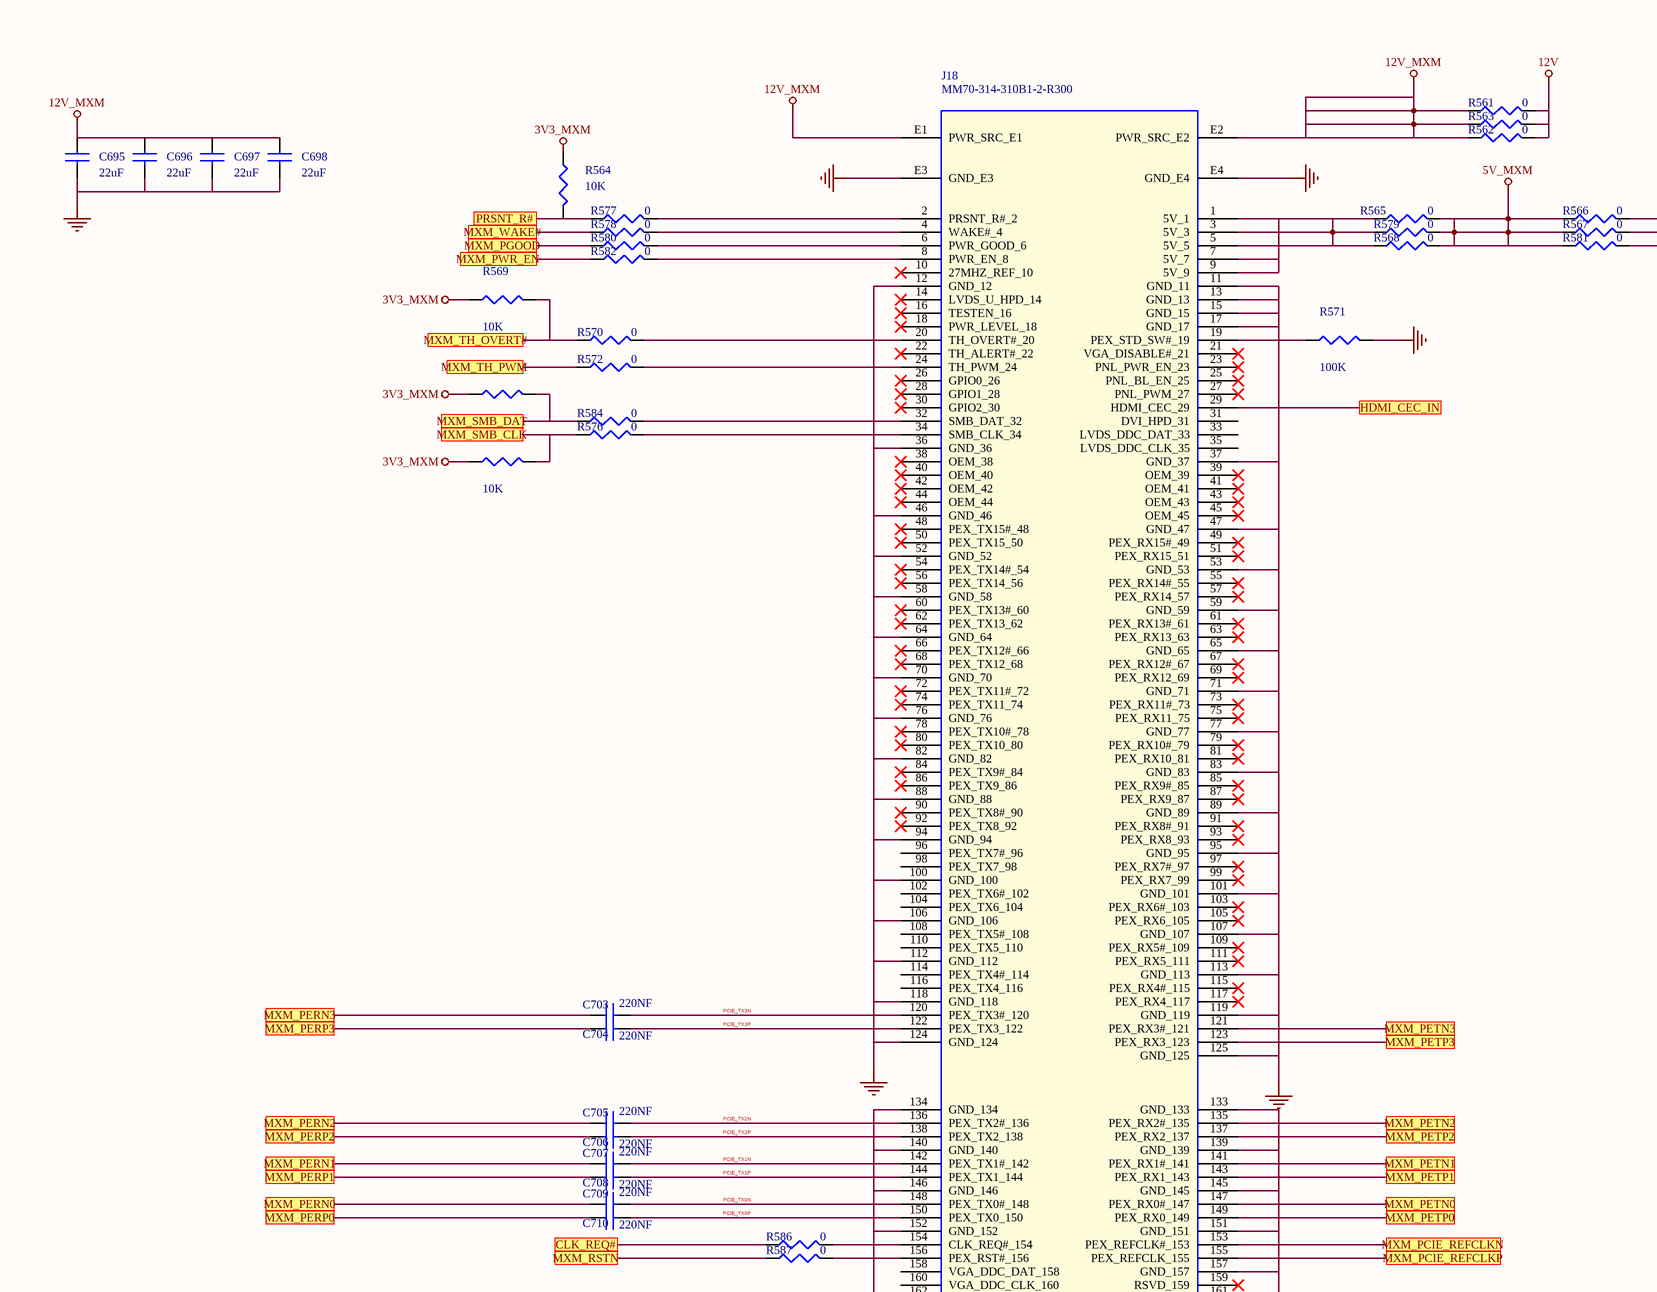
[diagram p46: 21 MXM_PCIe.SchDoc, top left]
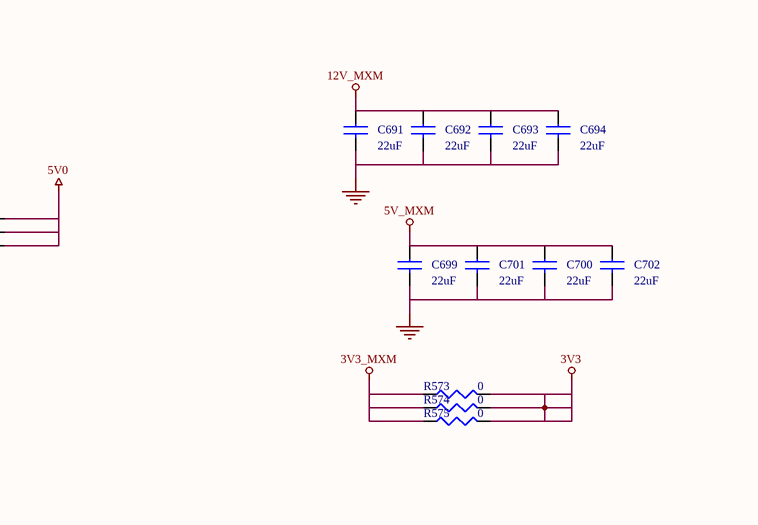
[diagram p47: 21 MXM_PCIe.SchDoc, top right]
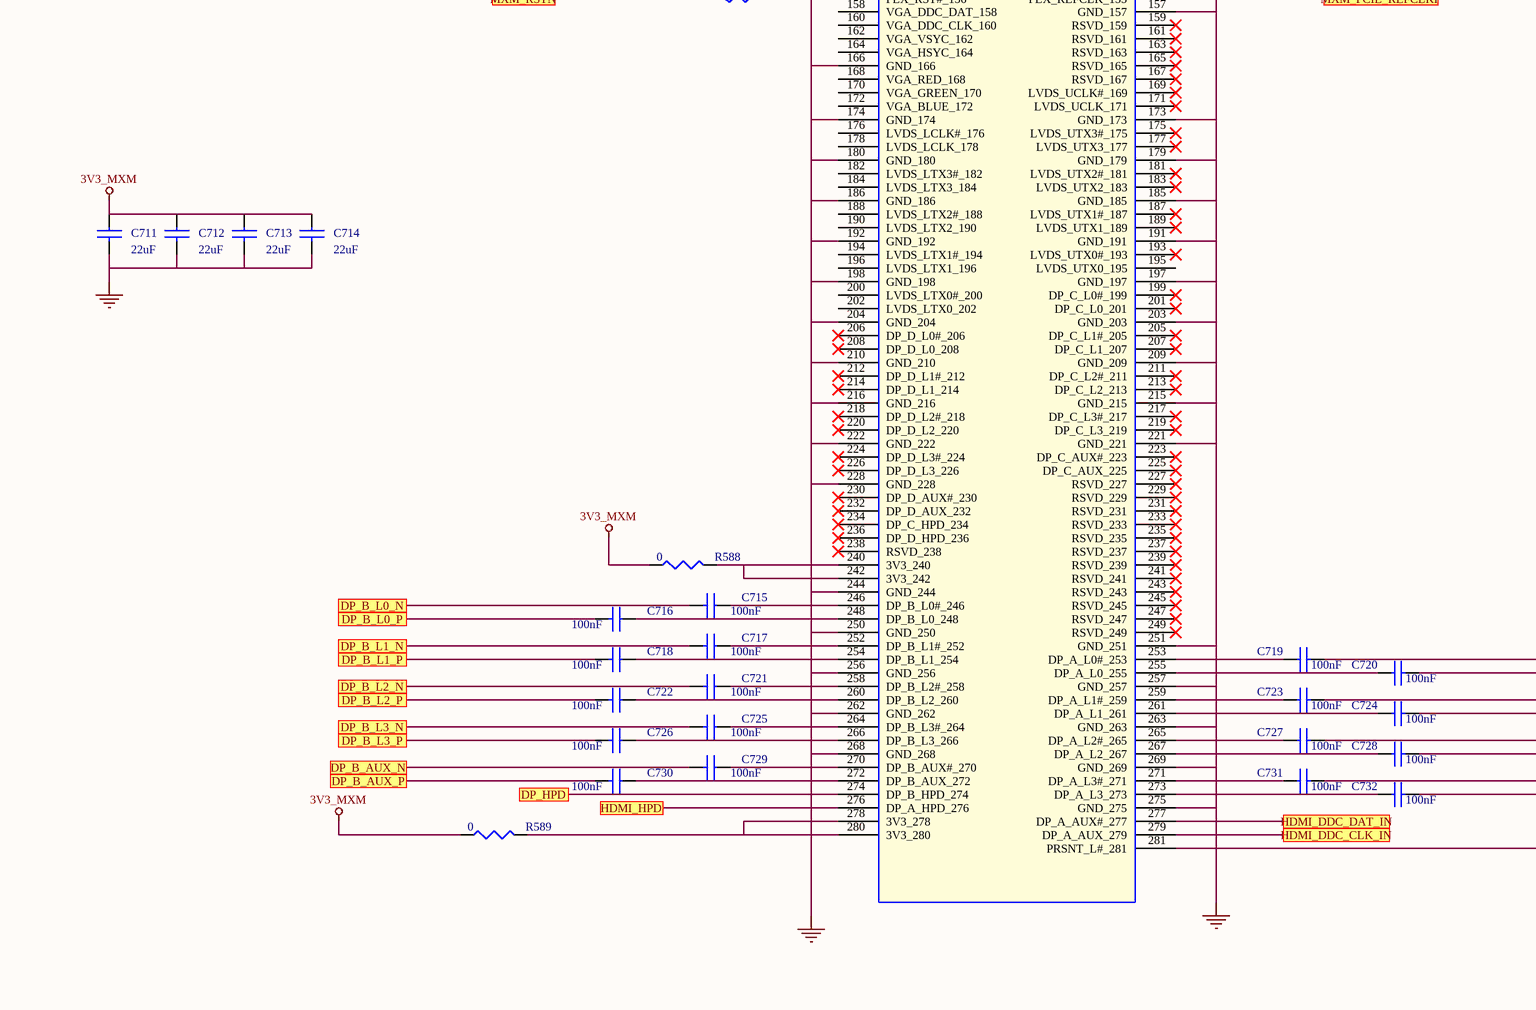
[diagram p48: 21 MXM_PCIe.SchDoc, bottom left]
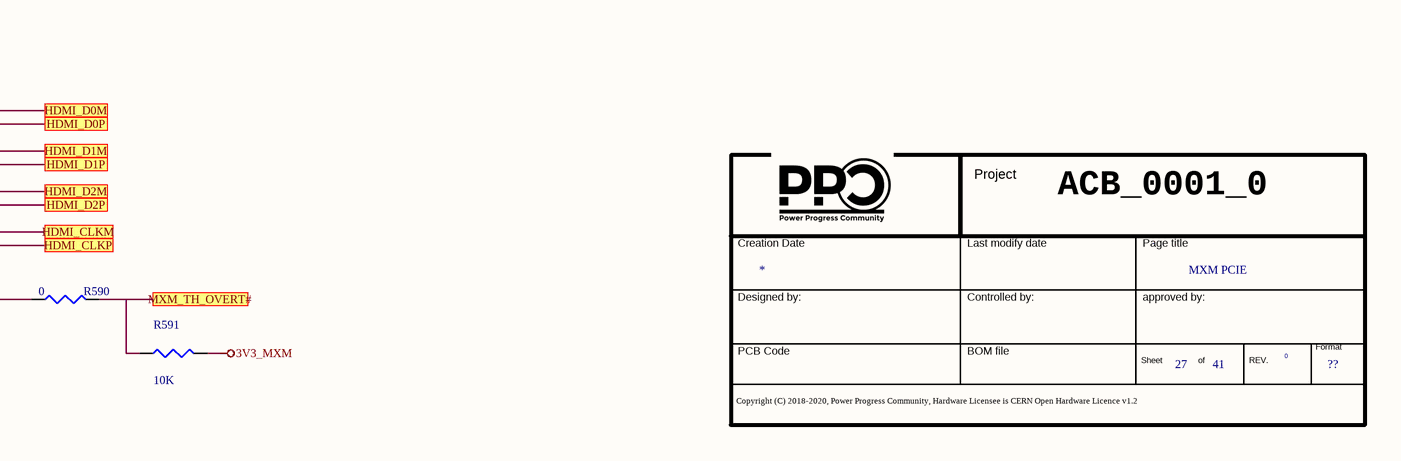
[diagram p49: 21 MXM_PCIe.SchDoc, bottom right]

### Parts
(Parts that share a designator on the sheet are numbered #1, #2 ... from top to bottom, then left to right.)
*#30  Doc: MXM PCIE  Page Count: 41  Page Number: 27  Page Size: ??  RevCode: 0  (hidden comment: Title_block_PPC)  (graphical)
C691  22uF  [SMD_0805]
C692  22uF  [SMD_0805]
C693  22uF  [SMD_0805]
C694  22uF  [SMD_0805]
C695  22uF  [SMD_0805]
C696  22uF  [SMD_0805]
C697  22uF  [SMD_0805]
C698  22uF  [SMD_0805]
C699  22uF  [SMD_0805]
C700  22uF  [SMD_0805]
C701  22uF  [SMD_0805]
C702  22uF  [SMD_0805]
C703  220NF  [SMD_0402]
C704  220NF  [SMD_0402]
C705  220NF  [SMD_0402]
C706  220NF  [SMD_0402]
C707  220NF  [SMD_0402]
C708  220NF  [SMD_0402]
C709  220NF  [SMD_0402]
C710  220NF  [SMD_0402]
C711  22uF  [SMD_0805]
C712  22uF  [SMD_0805]
C713  22uF  [SMD_0805]
C714  22uF  [SMD_0805]
C715  100nF  [SMD_0402]
C716  100nF  [SMD_0402]
C717  100nF  [SMD_0402]
C718  100nF  [SMD_0402]
C719  100nF  [SMD_0402]
C720  100nF  [SMD_0402]
C721  100nF  [SMD_0402]
C722  100nF  [SMD_0402]
C723  100nF  [SMD_0402]
C724  100nF  [SMD_0402]
C725  100nF  [SMD_0402]
C726  100nF  [SMD_0402]
C727  100nF  [SMD_0402]
C728  100nF  [SMD_0402]
C729  100nF  [SMD_0402]
C730  100nF  [SMD_0402]
C731  100nF  [SMD_0402]
C732  100nF  [SMD_0402]
J18  MM70-314-310B1-2-R300  [324 PIN 0.5mm]
R561  0  [SMD_1206]
R562  0  [SMD_1206]
R563  0  [SMD_1206]
R564  10K  [SMD_0402]
R565  0  [SMD_1206]
R566  0  [SMD_1206]
R567  0  [SMD_1206]
R568  0  [SMD_1206]
R569  10K  [SMD_0402]
R570  0  [SMD_0402]
R571  100K  [SMD_0402]
R572  0  [SMD_0402]
R573  0  [SMD_1206]
R574  0  [SMD_1206]
R575  0  [SMD_1206]
R576  0  [SMD_0402]
R577  0  [SMD_0402]
R578  0  [SMD_0402]
R579  0  [SMD_1206]
R580  0  [SMD_0402]
R581  0  [SMD_1206]
R582  0  [SMD_0402]
R583  10K  [SMD_0402]
R584  0  [SMD_0402]
R585  10K  [SMD_0402]
R586  0  [SMD_0402]
R587  0  [SMD_0402]
R588  0  [SMD_1206]
R589  0  [SMD_1206]
R590  0  [SMD_0402]
R591  10K  [SMD_0402]

### Ports
CLK_REQ#, DP_B_AUX_N, DP_B_AUX_P, DP_B_L0_N, DP_B_L0_P, DP_B_L1_N, DP_B_L1_P, DP_B_L2_N, DP_B_L2_P, DP_B_L3_N, DP_B_L3_P, DP_HPD, HDMI_CEC_IN, HDMI_CLKM, HDMI_CLKP, HDMI_D0M, HDMI_D0P, HDMI_D1M, HDMI_D1P, HDMI_D2M, HDMI_D2P, HDMI_DDC_CLK_IN, HDMI_DDC_DAT_IN, HDMI_HPD, MXM_PCIE_REFCLKN, MXM_PCIE_REFCLKP, MXM_PERN0, MXM_PERN1, MXM_PERN2, MXM_PERN3, MXM_PERP0, MXM_PERP1, MXM_PERP2, MXM_PERP3, MXM_PETN0, MXM_PETN1, MXM_PETN2, MXM_PETN3, MXM_PETP0, MXM_PETP1, MXM_PETP2, MXM_PETP3, MXM_PGOOD, MXM_PWR_EN, MXM_RSTN, MXM_SMB_CLK, MXM_SMB_DAT, MXM_TH_OVERT#, MXM_TH_PWM, MXM_WAKE#, PRSNT_R#

### Nets
3V3: R573.2 R574.2 R575.2
3V3_MXM: C711.1 C712.1 C713.1 C714.1 R564.1 R569.1 R573.1 R574.1 R575.1 R583.1 R585.1 R588.2 R589.2 R591.1
5V0: R566.2 R567.2 R581.2
5V_MXM: C699.1 C700.1 C701.1 C702.1 R565.2 R566.1 R567.1 R568.2 R579.2 R581.1
12V: R561.2 R562.2 R563.2
12V_MXM: C691.1 C692.1 C693.1 C694.1 C695.1 C696.1 C697.1 C698.1 J18.E1(PWR_SRC_E1) J18.E2(PWR_SRC_E2) R561.1 R562.1 R563.1
GND: C691.2 C692.2 C693.2 C694.2 C695.2 C696.2 C697.2 C698.2 C699.2 C700.2 C701.2 C702.2 C711.2 C712.2 C713.2 C714.2 J18.11(GND_11) J18.12(GND_12) J18.13(GND_13) J18.15(GND_15) J18.17(GND_17) J18.36(GND_36) J18.37(GND_37) J18.46(GND_46) J18.47(GND_47) J18.52(GND_52) J18.53(GND_53) J18.58(GND_58) J18.59(GND_59) J18.64(GND_64) J18.65(GND_65) J18.70(GND_70) J18.71(GND_71) J18.76(GND_76) J18.77(GND_77) J18.82(GND_82) J18.83(GND_83) J18.88(GND_88) J18.89(GND_89) J18.94(GND_94) J18.95(GND_95) J18.100(GND_100) J18.101(GND_101) J18.106(GND_106) J18.107(GND_107) J18.112(GND_112) J18.113(GND_113) J18.118(GND_118) J18.119(GND_119) J18.124(GND_124) J18.125(GND_125) J18.133(GND_133) J18.134(GND_134) J18.139(GND_139) J18.140(GND_140) J18.145(GND_145) J18.146(GND_146) J18.151(GND_151) J18.152(GND_152) J18.157(GND_157) J18.166(GND_166) J18.173(GND_173) J18.174(GND_174) J18.179(GND_179) J18.180(GND_180) J18.185(GND_185) J18.186(GND_186) J18.191(GND_191) J18.192(GND_192) J18.197(GND_197) J18.198(GND_198) J18.203(GND_203) J18.204(GND_204) J18.209(GND_209) J18.210(GND_210) J18.215(GND_215) J18.216(GND_216) J18.221(GND_221) J18.222(GND_222) J18.228(GND_228) J18.244(GND_244) J18.250(GND_250) J18.251(GND_251) J18.256(GND_256) J18.257(GND_257) J18.262(GND_262) J18.263(GND_263) J18.268(GND_268) J18.269(GND_269) J18.275(GND_275) J18.E3(GND_E3) J18.E4(GND_E4) R571.2
PCIE_TX0N: C709.2 J18.148(PEX_TX0#_148)
PCIE_TX0P: C710.2 J18.150(PEX_TX0_150)
PCIE_TX1N: C707.2 J18.142(PEX_TX1#_142)
PCIE_TX1P: C708.2 J18.144(PEX_TX1_144)
PCIE_TX2N: C705.2 J18.136(PEX_TX2#_136)
PCIE_TX2P: C706.2 J18.138(PEX_TX2_138)
PCIE_TX3N: C703.2 J18.120(PEX_TX3#_120)
PCIE_TX3P: C704.2 J18.122(PEX_TX3_122)
NetC93_2: J18.149(PEX_RX0_149) ; port MXM_PETP0
NetC94_2: J18.147(PEX_RX0#_147) ; port MXM_PETN0
NetC95_2: J18.143(PEX_RX1_143) ; port MXM_PETP1
NetC96_2: J18.141(PEX_RX1#_141) ; port MXM_PETN1
NetC97_2: J18.137(PEX_RX2_137) ; port MXM_PETP2
NetC98_2: J18.135(PEX_RX2#_135) ; port MXM_PETN2
NetC99_2: J18.123(PEX_RX3_123) ; port MXM_PETP3
NetC100_2: J18.121(PEX_RX3#_121) ; port MXM_PETN3
NetC703_1: C703.1 ; port MXM_PERN3
NetC704_1: C704.1 ; port MXM_PERP3
NetC705_1: C705.1 ; port MXM_PERN2
NetC706_1: C706.1 ; port MXM_PERP2
NetC707_1: C707.1 ; port MXM_PERN1
NetC708_1: C708.1 ; port MXM_PERP1
NetC709_1: C709.1 ; port MXM_PERN0
NetC710_1: C710.1 ; port MXM_PERP0
NetC715_1: C715.1 J18.246(DP_B_L0#_246)
NetC715_2: C715.2 ; port DP_B_L0_N
NetC716_1: C716.1 J18.248(DP_B_L0_248)
NetC716_2: C716.2 ; port DP_B_L0_P
NetC717_1: C717.1 J18.252(DP_B_L1#_252)
NetC717_2: C717.2 ; port DP_B_L1_N
NetC718_1: C718.1 J18.254(DP_B_L1_254)
NetC718_2: C718.2 ; port DP_B_L1_P
NetC719_1: C719.1 J18.253(DP_A_L0#_253)
NetC719_2: C719.2 ; port HDMI_D0M
NetC720_1: C720.1 J18.255(DP_A_L0_255)
NetC720_2: C720.2 ; port HDMI_D0P
NetC721_1: C721.1 J18.258(DP_B_L2#_258)
NetC721_2: C721.2 ; port DP_B_L2_N
NetC722_1: C722.1 J18.260(DP_B_L2_260)
NetC722_2: C722.2 ; port DP_B_L2_P
NetC723_1: C723.1 J18.259(DP_A_L1#_259)
NetC723_2: C723.2 ; port HDMI_D1M
NetC724_1: C724.1 J18.261(DP_A_L1_261)
NetC724_2: C724.2 ; port HDMI_D1P
NetC725_1: C725.1 J18.264(DP_B_L3#_264)
NetC725_2: C725.2 ; port DP_B_L3_N
NetC726_1: C726.1 J18.266(DP_B_L3_266)
NetC726_2: C726.2 ; port DP_B_L3_P
NetC727_1: C727.1 J18.265(DP_A_L2#_265)
NetC727_2: C727.2 ; port HDMI_D2M
NetC728_1: C728.1 J18.267(DP_A_L2_267)
NetC728_2: C728.2 ; port HDMI_D2P
NetC729_1: C729.1 J18.270(DP_B_AUX#_270)
NetC729_2: C729.2 ; port DP_B_AUX_N
NetC730_1: C730.1 J18.272(DP_B_AUX_272)
NetC730_2: C730.2 ; port DP_B_AUX_P
NetC731_1: C731.1 J18.271(DP_A_L3#_271)
NetC731_2: C731.2 ; port HDMI_CLKM
NetC732_1: C732.1 J18.273(DP_A_L3_273)
NetC732_2: C732.2 ; port HDMI_CLKP
NetC734_1: J18.276(DP_A_HPD_276) ; port HDMI_HPD
NetJ18_1: J18.1(5V_1) J18.3(5V_3) J18.5(5V_5) J18.7(5V_7) J18.9(5V_9) R565.1 R568.1 R579.1
NetJ18_2: J18.2(PRSNT_R#_2) R577.2
NetJ18_4: J18.4(WAKE#_4) R578.2
NetJ18_6: J18.6(PWR_GOOD_6) R580.2
NetJ18_8: J18.8(PWR_EN_8) R582.2
NetJ18_19: J18.19(PEX_STD_SW#_19) R571.1
NetJ18_20: J18.20(TH_OVERT#_20) R570.2
NetJ18_24: J18.24(TH_PWM_24) R572.2
NetJ18_29: J18.29(HDMI_CEC_29) ; port HDMI_CEC_IN
NetJ18_32: J18.32(SMB_DAT_32) R584.2
NetJ18_34: J18.34(SMB_CLK_34) R576.2
NetJ18_153: J18.153(PEX_REFCLK#_153) ; port MXM_PCIE_REFCLKN
NetJ18_154: J18.154(CLK_REQ#_154) R586.2
NetJ18_155: J18.155(PEX_REFCLK_155) ; port MXM_PCIE_REFCLKP
NetJ18_156: J18.156(PEX_RST#_156) R587.2
NetJ18_240: J18.240(3V3_240) J18.242(3V3_242) R588.1
NetJ18_274: J18.274(DP_B_HPD_274) ; port DP_HPD
NetJ18_277: J18.277(DP_A_AUX#_277) ; port HDMI_DDC_DAT_IN
NetJ18_278: J18.278(3V3_278) J18.280(3V3_280) R589.1
NetJ18_279: J18.279(DP_A_AUX_279) ; port HDMI_DDC_CLK_IN
NetJ18_281: J18.281(PRSNT_L#_281) R590.2
NetR289_2: R587.1 ; port MXM_RSTN
NetR301_2: R564.2 R577.1 ; port PRSNT_R#
NetR302_2: R578.1 ; port MXM_WAKE#
NetR311_2: R572.1 ; port MXM_TH_PWM
NetR317_2: R586.1 ; port CLK_REQ#
NetR330_2: R580.1 ; port MXM_PGOOD
NetR332_2: R582.1 ; port MXM_PWR_EN
NetR569_2: R569.2 R570.1 R590.1 R591.2 ; port MXM_TH_OVERT#
NetR576_1: R576.1 R585.2 ; port MXM_SMB_CLK
NetR583_2: R583.2 R584.1 ; port MXM_SMB_DAT

Not connected (* = marked no-connect by the designer): J18 10(27MHZ_REF_10)* 14(LVDS_U_HPD_14)* 16(TESTEN_16)* 18(PWR_LEVEL_18)* 21(VGA_DISABLE#_21)* 22(TH_ALERT#_22)* 23(PNL_PWR_EN_23)* 25(PNL_BL_EN_25)* 26(GPIO0_26)* 27(PNL_PWM_27)* 28(GPIO1_28)* 30(GPIO2_30)* 31(DVI_HPD_31) 33(LVDS_DDC_DAT_33) 35(LVDS_DDC_CLK_35) 38(OEM_38)* 39(OEM_39)* 40(OEM_40)* 41(OEM_41)* 42(OEM_42)* 43(OEM_43)* 44(OEM_44)* 45(OEM_45)* 48(PEX_TX15#_48)* 49(PEX_RX15#_49)* 50(PEX_TX15_50)* 51(PEX_RX15_51)* 54(PEX_TX14#_54)* 55(PEX_RX14#_55)* 56(PEX_TX14_56)* 57(PEX_RX14_57)* 60(PEX_TX13#_60)* 61(PEX_RX13#_61)* 62(PEX_TX13_62)* 63(PEX_RX13_63)* 66(PEX_TX12#_66)* 67(PEX_RX12#_67)* 68(PEX_TX12_68)* 69(PEX_RX12_69)* 72(PEX_TX11#_72)* 73(PEX_RX11#_73)* 74(PEX_TX11_74)* 75(PEX_RX11_75)* 78(PEX_TX10#_78)* 79(PEX_RX10#_79)* 80(PEX_TX10_80)* 81(PEX_RX10_81)* 84(PEX_TX9#_84)* 85(PEX_RX9#_85)* 86(PEX_TX9_86)* 87(PEX_RX9_87)* 90(PEX_TX8#_90)* 91(PEX_RX8#_91)* 92(PEX_TX8_92)* 93(PEX_RX8_93)* 96(PEX_TX7#_96) 97(PEX_RX7#_97)* 98(PEX_TX7_98) 99(PEX_RX7_99)* 102(PEX_TX6#_102) 103(PEX_RX6#_103)* 104(PEX_TX6_104) 105(PEX_RX6_105)* 108(PEX_TX5#_108) 109(PEX_RX5#_109)* 110(PEX_TX5_110) 111(PEX_RX5_111)* 114(PEX_TX4#_114) 115(PEX_RX4#_115)* 116(PEX_TX4_116) 117(PEX_RX4_117)* 158(VGA_DDC_DAT_158) 159(RSVD_159)* 160(VGA_DDC_CLK_160) 161(RSVD_161)* 162(VGA_VSYC_162) 163(RSVD_163)* 164(VGA_HSYC_164) 165(RSVD_165)* 167(RSVD_167)* 168(VGA_RED_168) 169(LVDS_UCLK#_169)* 170(VGA_GREEN_170) 171(LVDS_UCLK_171)* 172(VGA_BLUE_172) 175(LVDS_UTX3#_175)* 176(LVDS_LCLK#_176) 177(LVDS_UTX3_177)* 178(LVDS_LCLK_178) 181(LVDS_UTX2#_181)* 182(LVDS_LTX3#_182) 183(LVDS_UTX2_183)* 184(LVDS_LTX3_184) 187(LVDS_UTX1#_187)* 188(LVDS_LTX2#_188) 189(LVDS_UTX1_189)* 190(LVDS_LTX2_190) 193(LVDS_UTX0#_193)* 194(LVDS_LTX1#_194) 195(LVDS_UTX0_195) 196(LVDS_LTX1_196) 199(DP_C_L0#_199)* 200(LVDS_LTX0#_200) 201(DP_C_L0_201)* 202(LVDS_LTX0_202) 205(DP_C_L1#_205)* 206(DP_D_L0#_206)* 207(DP_C_L1_207)* 208(DP_D_L0_208)* 211(DP_C_L2#_211)* 212(DP_D_L1#_212)* 213(DP_C_L2_213)* 214(DP_D_L1_214)* 217(DP_C_L3#_217)* 218(DP_D_L2#_218)* 219(DP_C_L3_219)* 220(DP_D_L2_220)* 223(DP_C_AUX#_223)* 224(DP_D_L3#_224)* 225(DP_C_AUX_225)* 226(DP_D_L3_226)* 227(RSVD_227)* 229(RSVD_229)* 230(DP_D_AUX#_230)* 231(RSVD_231)* 232(DP_D_AUX_232)* 233(RSVD_233)* 234(DP_C_HPD_234)* 235(RSVD_235)* 236(DP_D_HPD_236)* 237(RSVD_237)* 238(RSVD_238)* 239(RSVD_239)* 241(RSVD_241)* 243(RSVD_243)* 245(RSVD_245)* 247(RSVD_247)* 249(RSVD_249)*

### Notes on the sheet
- ACB_0001_0

### Library data of the parts
*#30 = Title_block_PPC: Title: T2080PCIe; Schematic Page Count: 45; Schematic Page Number: 30; Author: MICETEK; Page Create Date: March  8, 1995; Page Title: ?; Page Modify Date: *
C691-C702 C711-C714 = CAP NP_Dup2: 22UF 35V 20% 0805; Manufacturer Part Number 1: C2012X5R1V226M125AC; Manufacturer 1: TDK; Part Number: PASSIVE_224; RSM: RC0805; PCB Footprint: SMD_0805; Part Type: Capacitors\Ceramic\SMD\0805
C703-C710 = CAP NP_Dup9: COND.CER. 220NF 10V 0402 X7R SMD; Part Number: PASSIVE_59; Manufacturer 1: Murata; Manufacturer Part Number 1: GRM155R61A224KE19; RSM: RC0402; PCB Footprint: SMD_0402; Part Type: Capacitors\Ceramic\SMD\0402; Distributor 1: MURATA ELETTRONICA SPA
C715 C717 C721 C725 C729 = CAP NP_Dup2: COND.CER. 100NF 50V 0402 X7R SMD; Part Number: PASSIVE_24; Manufacturer 1: TDK; Manufacturer Part Number 1: CGA2B3X7R1H104M050BD; RSM: RC0402; PCB Footprint: SMD_0402; Part Type: Capacitors\Ceramic\SMD\0402; Distributor 1: DIGKEY (445-9694-2-ND)
C716 C718-C720 C722-C724 C726-C728 C730-C732 = CAP NP_Dup2: COND.CER. 100NF 50V 0402 X7R SMD; Manufacturer Part Number 1: CGA2B3X7R1H104M050BD; Manufacturer 1: TDK; Part Number: PASSIVE_24; RSM: RC0402; PCB Footprint: SMD_0402; Distributor 1: DIGKEY (445-9694-2-ND); Part Type: Capacitors\Ceramic\SMD\0402
J18 = CON_MXM_31_2x140: MXM3.0 CARD EDGE CONNECTOR; Part Number: CONNECTORS_626; Manufacturer 1: JAE ELECTRONICS; RSM: PCI-MM70-314-310B1-2-R300; PCB Footprint: 324 PIN 0.5mm; Part Type: EDGE CONNECTOR; Manufacturer Part Number 1: MM70-314-310B1-2-R300; Distributor 1: MOUSER(656-MM70314310B12R)
R561-R563 R566-R568 R579 R581 = R_Dup5: RESIS. 0R 1/4W 1206 SMD E96; Part Number: PASSIVE_1266; Manufacturer 1: ASJ; Manufacturer Part Number 1: CR32000ZL; RSM: RC1206; PCB Footprint: SMD_1206; Part Type: Resistors\Fixed\SMD\1206\5%
R564 R569 R583 R585 R591 = R_Dup5: RESIS.CHIP 10K 1% 0402 SMD; Manufacturer 1: ROYAL OHM; Part Number: PASSIVE_584; RSM: RC0402; Manufacturer Part Number 1: RESIS.CHIP 10K 1% 0402 SMD; PCB Footprint: SMD_0402; Part Type: Resistors\Fixed\SMD\0402\1%
R565 R589 = R_Dup8: RESIS. 0R 1/4W 1206 SMD E96; Manufacturer Part Number 1: CR32000ZL; Manufacturer 1: ASJ; Part Number: PASSIVE_1266; RSM: RC1206; PCB Footprint: SMD_1206; Distributor 1: TTI ITALY SRL; Part Type: Resistors\Fixed\SMD\1206\5%
R570 R572 R576 R584 R587 = R_Dup8: RESIS.CHIP 0R 5% 0402 SMD; Manufacturer 1: ROYAL OHM; Part Number: PASSIVE_805; RSM: RC0402; PCB Footprint: SMD_0402; Distributor 1: CAMEL ELETTRONICA SRL  #; Manufacturer Part Number 1: RESIS.CHIP 0R 5% 0402 SMD; Part Type: Resistors\Fixed\SMD\0402\5%
R571 = R_Dup5: RESIS.CHIP 100K 5% 0402 SMD; Manufacturer 1: ROYAL OHM; Part Number: PASSIVE_813; RSM: RC0402; Manufacturer Part Number 1: RESIS.CHIP 100K 5% 0402 SMD; PCB Footprint: SMD_0402; Part Type: Resistors\Fixed\SMD\0402\5%
R573-R575 = R_Dup5: RESIS. 0R 1/4W 1206 SMD E96; Manufacturer Part Number 1: CR32000ZL; Manufacturer 1: ASJ; Part Number: PASSIVE_1266; RSM: RC1206; PCB Footprint: SMD_1206; Part Type: Resistors\Fixed\SMD\1206\5%
R577 R578 R580 R582 R586 R590 = R_Dup8: RESIS.CHIP 0R 5% 0402 SMD; Part Number: PASSIVE_805; Manufacturer 1: ROYAL OHM; RSM: RC0402; PCB Footprint: SMD_0402; Part Type: Resistors\Fixed\SMD\0402\5%; Manufacturer Part Number 1: RESIS.CHIP 0R 5% 0402 SMD; Distributor 1: CAMEL ELETTRONICA SRL  #
R588 = R_Dup8: RESIS. 0R 1/4W 1206 SMD E96; Part Number: PASSIVE_1266; Manufacturer 1: ASJ; Manufacturer Part Number 1: CR32000ZL; RSM: RC1206; PCB Footprint: SMD_1206; Part Type: Resistors\Fixed\SMD\1206\5%; Distributor 1: TTI ITALY SRL